# EAGLE design homecomputer-6502 (EAGLE 6.5.0)

## Sheet 1 of 5
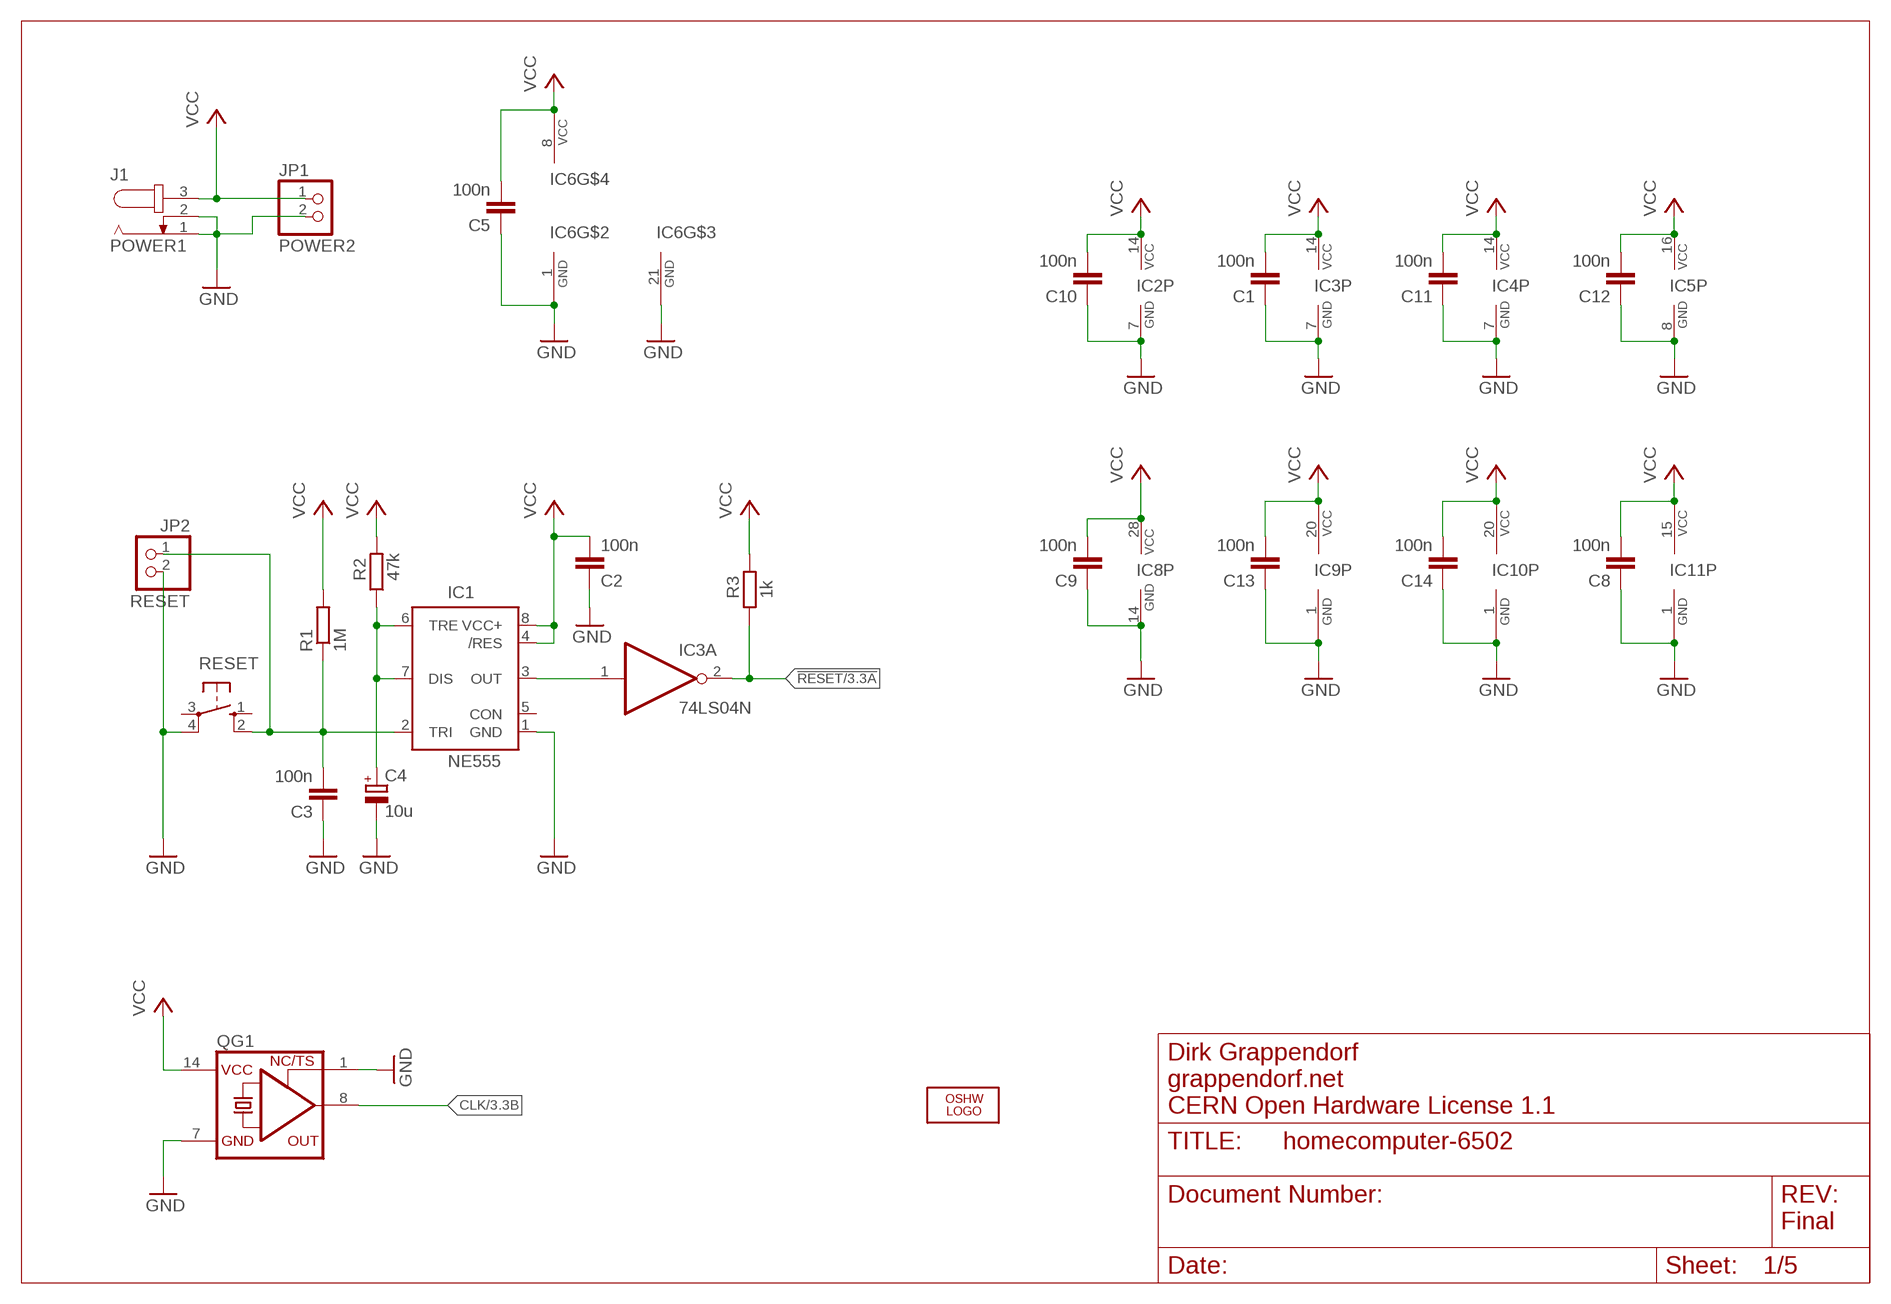
[diagram p0: schematic, sheet 1]

### Parts
C1  100n  C-EU025-024X044  [C025-024X044]
C2  100n  C-EU025-024X044  [C025-024X044]
C3  100n  C-EU025-024X044  [C025-024X044]
C4  10u  CPOL-EUE2,5-6E  [E2,5-6E]
C5  100n  C-EU025-024X044  [C025-024X044]
C8  100n  C-EU025-024X044  [C025-024X044]
C9  100n  C-EU025-024X044  [C025-024X044]
C10  100n  C-EU025-024X044  [C025-024X044]
C11  100n  C-EU025-024X044  [C025-024X044]
C12  100n  C-EU025-024X044  [C025-024X044]
C13  100n  C-EU025-024X044  [C025-024X044]
C14  100n  C-EU025-024X044  [C025-024X044]
IC1  NE555  [DIL-08]
IC2  74LS00N  [DIL14]
IC3  74LS04N  [DIL14]
IC4  74LS30N  [DIL14]
IC5  74LS137N  [DIL16]
IC6  6502  [DIP40]
IC8  61256  [DIL28-3]
IC9  6522  [DIP40]
IC10  6522  [DIP40]
IC11  6551  [DIP28]
J1  POWER1  JACK-PLUG1  [SPC4078]
JP1  POWER2  PINHD-1X2_2.54  [1X02]
JP2  RESET  PINHD-1X2_2.54  [1X02]
LOGO1  OSHW_LOGO_8MILX0350-NT  [OSHW_8X350_NOTEXT]
QG1  XO-14  [DIL14S]
R1  1M  R-EU_0204/7  [0204/7]
R2  47k  R-EU_0204/7  [0204/7]
R3  1k  R-EU_0204/7  [0204/7]
RESET  10-XX  [B3F-10XX]

### Nets
!RESET: IC3.2(A:O) R3.1 ; also sheet 3,4,5
CLK: QG1.8(OUT) ; also sheet 3
GND: C1.1 C2.1 C3.1 C4.- C5.1 C8.1 C9.1 C10.1 C11.1 C12.1 C13.1 C14.1 IC1.1(GND) IC2.7(P:GND) IC3.7(P:GND) IC4.7(GND) IC5.8(GND) IC6.1(GND) IC6.21(GND) IC8.14(GND) IC9.1(GND) IC10.1(GND) IC11.1(GND) J1.1 J1.2 JP1.2 JP2.2 QG1.1(TS) QG1.7(GND) RESET.4(P1) ; also sheet 2,3,4,5
N$4: C4.+ IC1.6(TRE) IC1.7(DIS) R2.1
N$5: IC1.3(OUT) IC3.1(A:I)
N$6: C3.2 IC1.2(TRI) JP2.1 R1.1 RESET.2(S1)
VCC: C1.2 C2.2 C5.2 C8.2 C9.2 C10.2 C11.2 C12.2 C13.2 C14.2 IC1.4(/RES) IC1.8(VCC+) IC2.14(P:VCC) IC3.14(P:VCC) IC4.14(VCC) IC5.16(VCC) IC6.8(VCC) IC8.28(VCC) IC9.20(VCC) IC10.20(VCC) IC11.15(VCC) J1.3 JP1.1 QG1.14(VCC) R1.2 R2.2 R3.2 ; also sheet 2,3,4,5
Unconnected: IC1.5(CON) IC2.8(C:O) IC2.9(C:I0) IC2.10(C:I1) IC2.11(D:O) IC2.12(D:I0) IC2.13(D:I1) IC3.5(C:I) IC3.6(C:O) IC3.8(D:O) IC3.9(D:I) IC3.12(F:O) IC3.13(F:I) RESET.1(S) RESET.3(P)

### Notes on the sheet
- Dirk Grappendorf
- grappendorf.net
- CERN Open Hardware License 1.1
- Final

## Sheet 2 of 5
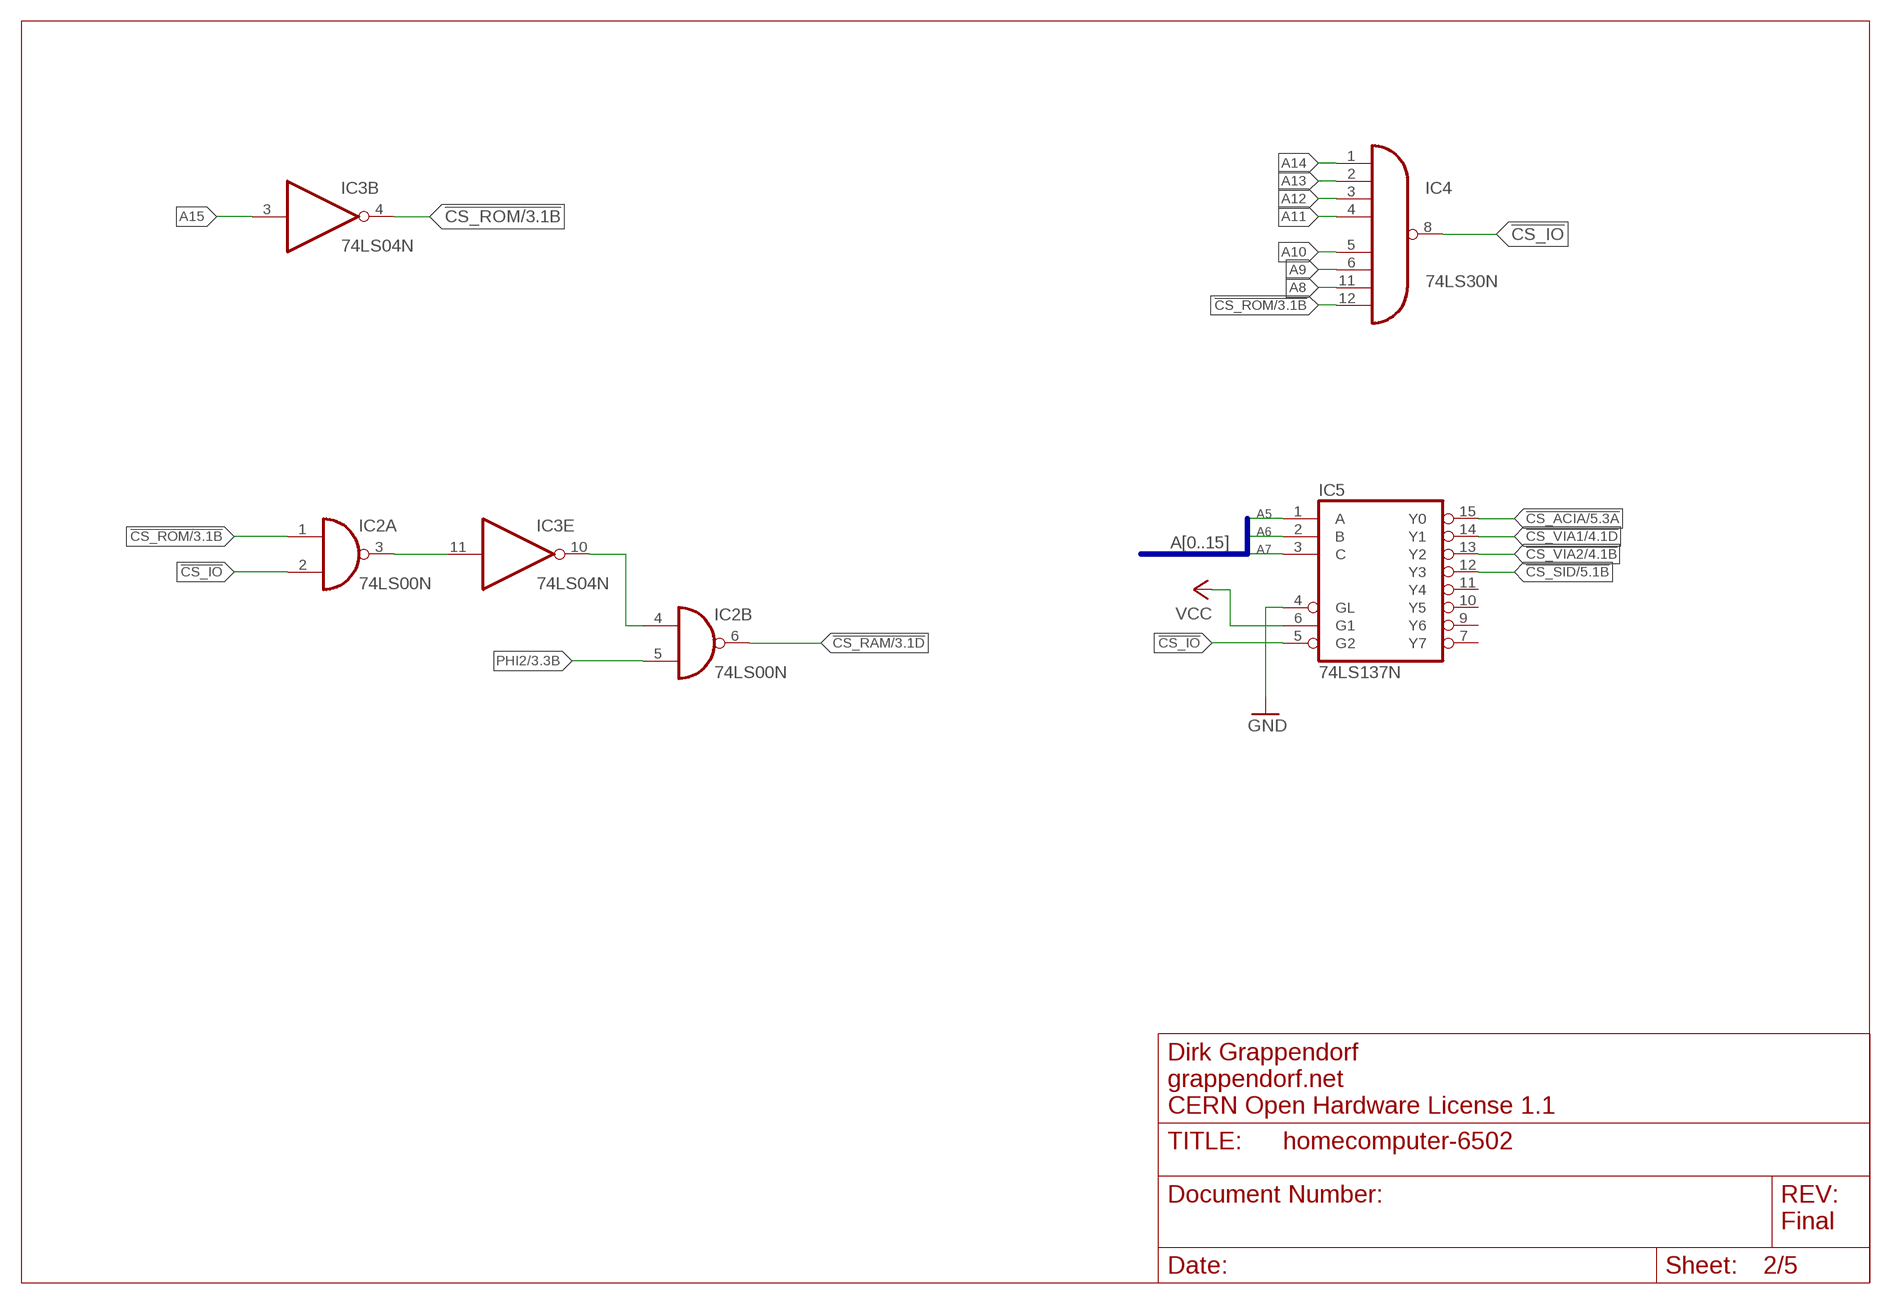
[diagram p1: schematic, sheet 2]

### Nets
!CS_ACIA: IC5.15(Y0) ; also sheet 5
!CS_IO: IC2.2(A:I1) IC4.8(O) IC5.5(G2)
!CS_RAM: IC2.6(B:O) ; also sheet 3
!CS_ROM: IC2.1(A:I0) IC3.4(B:O) IC4.12(I7) ; also sheet 3
!CS_SID: IC5.12(Y3) ; also sheet 5
!CS_VIA1: IC5.14(Y1) ; also sheet 4
!CS_VIA2: IC5.13(Y2) ; also sheet 4
A5: IC5.1(A) ; also sheet 3
A6: IC5.2(B) ; also sheet 3
A7: IC5.3(C) ; also sheet 3
A8: IC4.11(I6) ; also sheet 3
A9: IC4.6(I5) ; also sheet 3
A10: IC4.5(I4) ; also sheet 3
A11: IC4.4(I3) ; also sheet 3
A12: IC4.3(I2) ; also sheet 3
A13: IC4.2(I1) ; also sheet 3
A14: IC4.1(I0) ; also sheet 3
A15: IC3.3(B:I) ; also sheet 3
GND: IC5.4(GL) ; also sheet 1,3,4,5
N$7: IC2.3(A:O) IC3.11(E:I)
N$13: IC2.4(B:I0) IC3.10(E:O)
PHI2: IC2.5(B:I1) ; also sheet 3,4,5
VCC: IC5.6(G1) ; also sheet 1,3,4,5
Unconnected: IC5.7(Y7) IC5.9(Y6) IC5.10(Y5) IC5.11(Y4)

### Buses
A[0..15]

### Notes on the sheet
- Dirk Grappendorf
- grappendorf.net
- CERN Open Hardware License 1.1
- Final

## Sheet 3 of 5
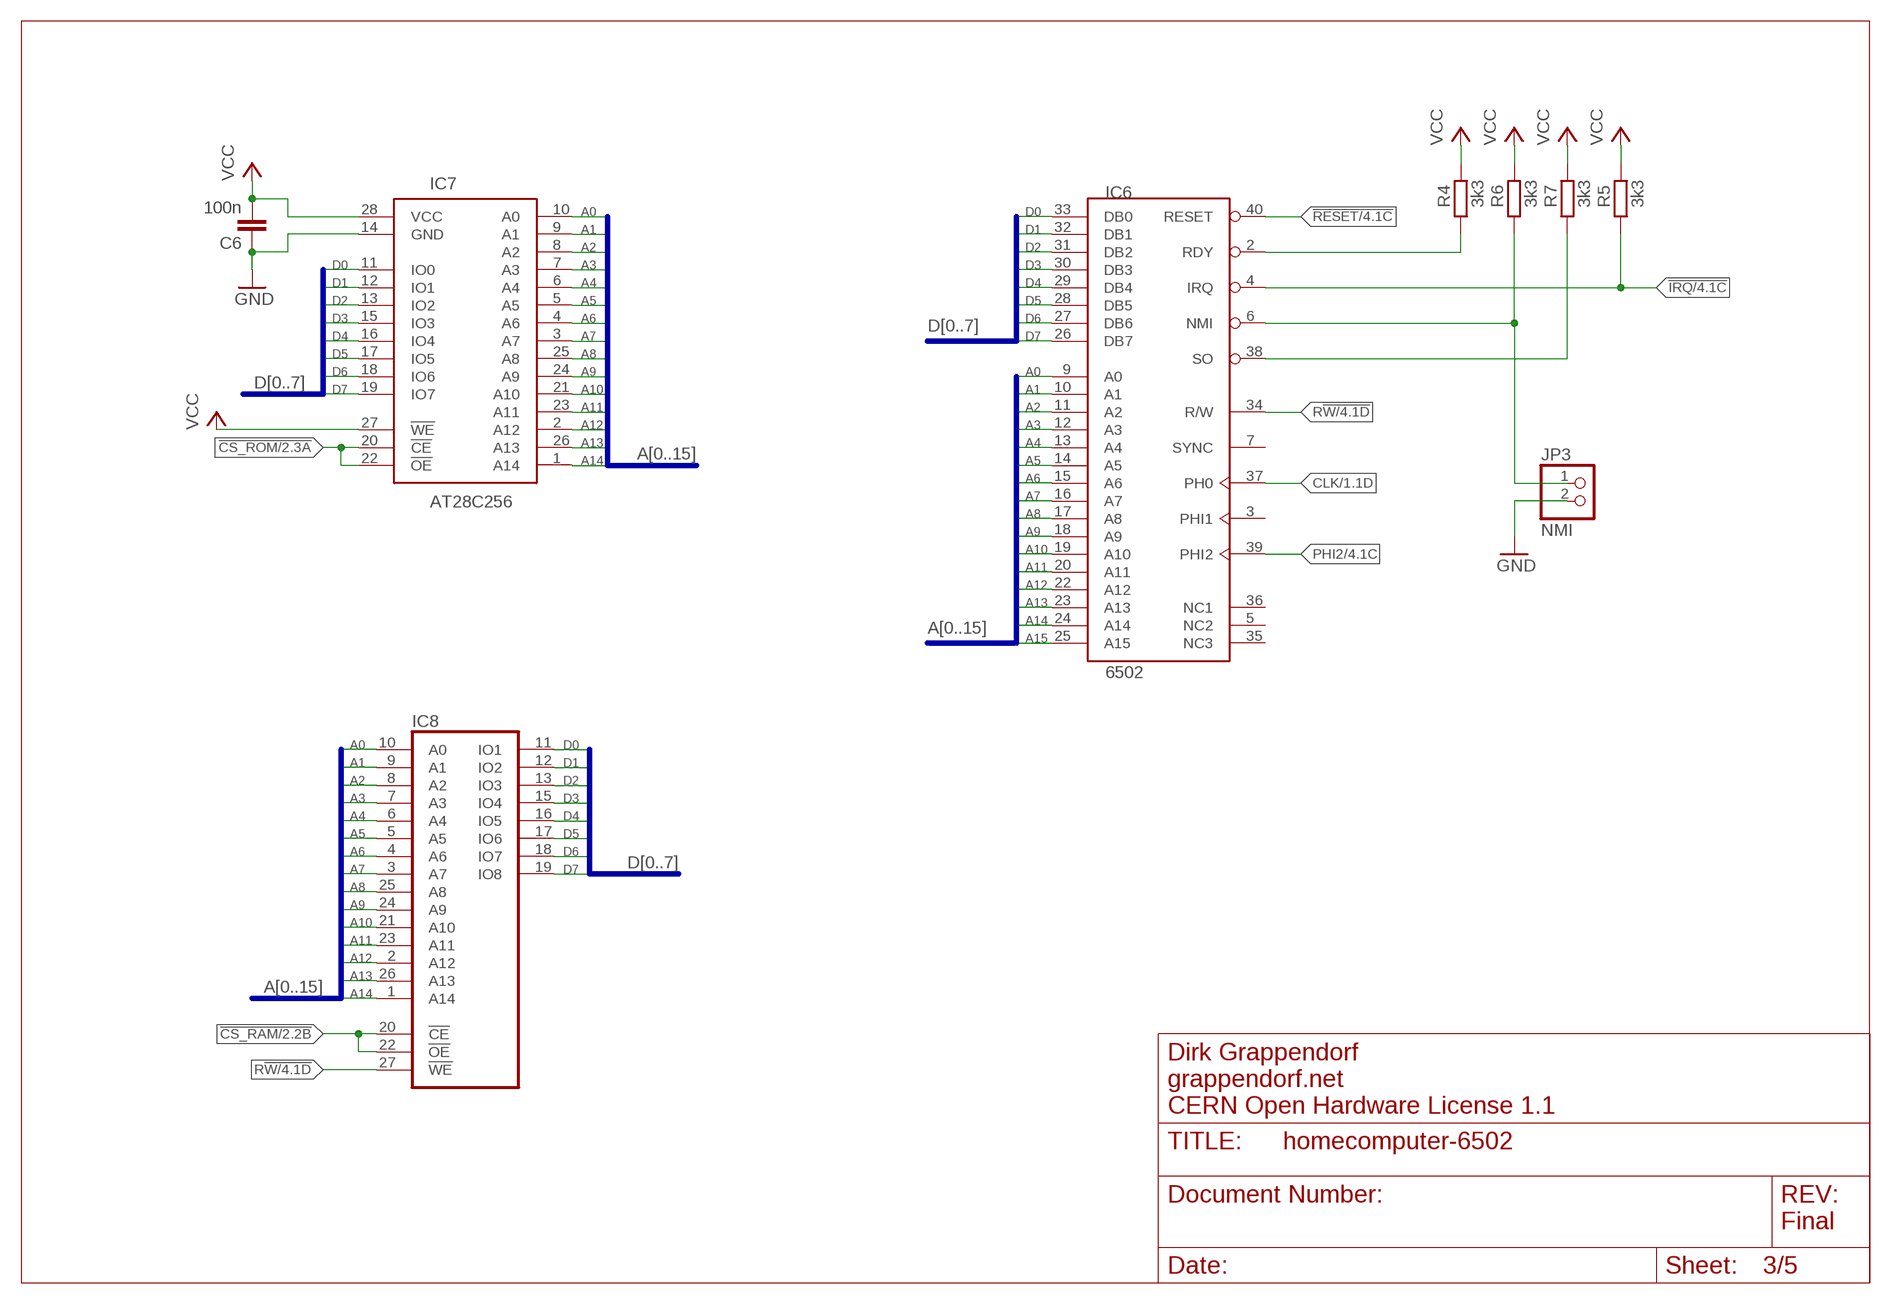
[diagram p2: schematic, sheet 3]

### Parts
C6  100n  C-EU025-024X044  [C025-024X044]
IC7  AT28C256  [DIL28-6]
JP3  NMI  PINHD-1X2_2.54  [1X02]
R4  3k3  R-EU_0204/7  [0204/7]
R5  3k3  R-EU_0204/7  [0204/7]
R6  3k3  R-EU_0204/7  [0204/7]
R7  3k3  R-EU_0204/7  [0204/7]

### Nets
!CS_RAM: IC8.20(!CE) IC8.22(!OE) ; also sheet 2
!CS_ROM: IC7.20(!CE) IC7.22(!OE) ; also sheet 2
!IRQ: IC6.4(IRQ) R5.1 ; also sheet 4,5
!RESET: IC6.40(RESET) ; also sheet 1,4,5
A0: IC6.9(A0) IC7.10(A0) IC8.10(A0) ; also sheet 4,5
A1: IC6.10(A1) IC7.9(A1) IC8.9(A1) ; also sheet 4,5
A2: IC6.11(A2) IC7.8(A2) IC8.8(A2) ; also sheet 4,5
A3: IC6.12(A3) IC7.7(A3) IC8.7(A3) ; also sheet 4,5
A4: IC6.13(A4) IC7.6(A4) IC8.6(A4) ; also sheet 5
A5: IC6.14(A5) IC7.5(A5) IC8.5(A5) ; also sheet 2
A6: IC6.15(A6) IC7.4(A6) IC8.4(A6) ; also sheet 2
A7: IC6.16(A7) IC7.3(A7) IC8.3(A7) ; also sheet 2
A8: IC6.17(A8) IC7.25(A8) IC8.25(A8) ; also sheet 2
A9: IC6.18(A9) IC7.24(A9) IC8.24(A9) ; also sheet 2
A10: IC6.19(A10) IC7.21(A10) IC8.21(A10) ; also sheet 2
A11: IC6.20(A11) IC7.23(A11) IC8.23(A11) ; also sheet 2
A12: IC6.22(A12) IC7.2(A12) IC8.2(A12) ; also sheet 2
A13: IC6.23(A13) IC7.26(A13) IC8.26(A13) ; also sheet 2
A14: IC6.24(A14) IC7.1(A14) IC8.1(A14) ; also sheet 2
A15: IC6.25(A15) ; also sheet 2
CLK: IC6.37(PH0) ; also sheet 1
D0: IC6.33(DB0) IC7.11(IO0) IC8.11(IO1) ; also sheet 4,5
D1: IC6.32(DB1) IC7.12(IO1) IC8.12(IO2) ; also sheet 4,5
D2: IC6.31(DB2) IC7.13(IO2) IC8.13(IO3) ; also sheet 4,5
D3: IC6.30(DB3) IC7.15(IO3) IC8.15(IO4) ; also sheet 4,5
D4: IC6.29(DB4) IC7.16(IO4) IC8.16(IO5) ; also sheet 4,5
D5: IC6.28(DB5) IC7.17(IO5) IC8.17(IO6) ; also sheet 4,5
D6: IC6.27(DB6) IC7.18(IO6) IC8.18(IO7) ; also sheet 4,5
D7: IC6.26(DB7) IC7.19(IO7) IC8.19(IO8) ; also sheet 4,5
GND: C6.1 IC7.14(GND) JP3.2 ; also sheet 1,2,4,5
N$3: IC6.2(RDY) R4.1
N$10: IC6.6(NMI) JP3.1 R6.1
N$11: IC6.38(SO) R7.1
PHI2: IC6.39(PHI2) ; also sheet 2,4,5
R!W: IC6.34(R/W) IC8.27(!WE) ; also sheet 4,5
VCC: C6.2 IC7.27(!WE) IC7.28(VCC) R4.2 R5.2 R6.2 R7.2 ; also sheet 1,2,4,5
Unconnected: IC6.3(PHI1) IC6.5(NC2) IC6.7(SYNC) IC6.35(NC3) IC6.36(NC1)

### Buses
A[0..15]
D[0..7]

### Notes on the sheet
- Dirk Grappendorf
- grappendorf.net
- CERN Open Hardware License 1.1
- Final

## Sheet 4 of 5
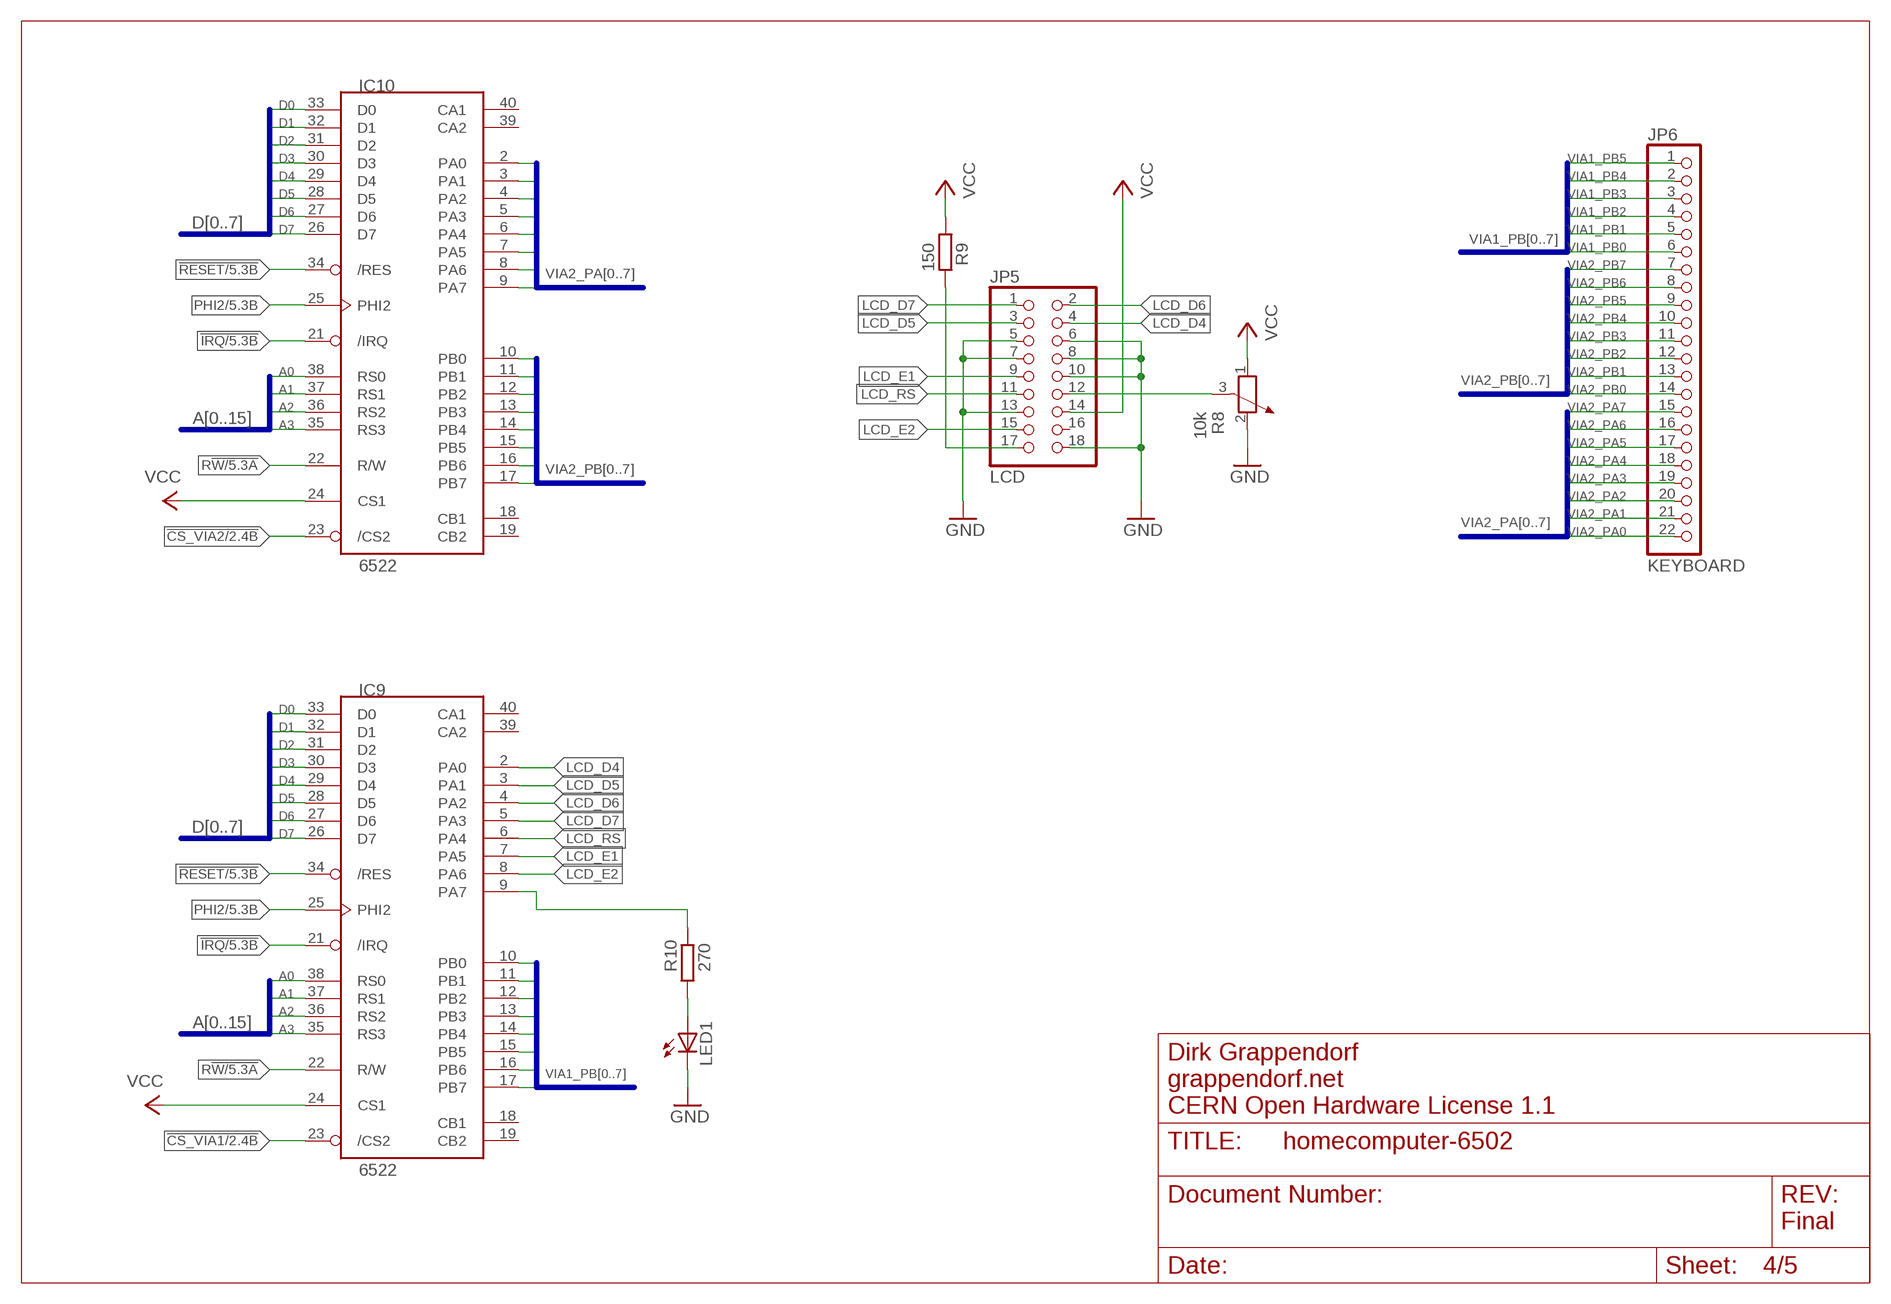
[diagram p3: schematic, sheet 4]

### Parts
JP5  LCD  PINHD-2X9_2.54  [2X09]
JP6  KEYBOARD  PINHD-1X22_2.54  [1X22]
LED1  LED3MM  [LED3MM]
R8  10k  POTENTIOMETER_PT-10  [PT-10]
R9  150  R-EU_0204/7  [0204/7]
R10  270  R-EU_0204/7  [0204/7]

### Nets
!CS_VIA1: IC9.23(/CS2) ; also sheet 2
!CS_VIA2: IC10.23(/CS2) ; also sheet 2
!IRQ: IC9.21(/IRQ) IC10.21(/IRQ) ; also sheet 3,5
!RESET: IC9.34(/RES) IC10.34(/RES) ; also sheet 1,3,5
A0: IC9.38(RS0) IC10.38(RS0) ; also sheet 3,5
A1: IC9.37(RS1) IC10.37(RS1) ; also sheet 3,5
A2: IC9.36(RS2) IC10.36(RS2) ; also sheet 3,5
A3: IC9.35(RS3) IC10.35(RS3) ; also sheet 3,5
D0: IC9.33(D0) IC10.33(D0) ; also sheet 3,5
D1: IC9.32(D1) IC10.32(D1) ; also sheet 3,5
D2: IC9.31(D2) IC10.31(D2) ; also sheet 3,5
D3: IC9.30(D3) IC10.30(D3) ; also sheet 3,5
D4: IC9.29(D4) IC10.29(D4) ; also sheet 3,5
D5: IC9.28(D5) IC10.28(D5) ; also sheet 3,5
D6: IC9.27(D6) IC10.27(D6) ; also sheet 3,5
D7: IC9.26(D7) IC10.26(D7) ; also sheet 3,5
GND: JP5.5 JP5.6 JP5.7 JP5.8 JP5.10 JP5.13 JP5.18 LED1.K(C) R8.2 ; also sheet 1,2,3,5
LCD_D4: IC9.2(PA0) JP5.4
LCD_D5: IC9.3(PA1) JP5.3
LCD_D6: IC9.4(PA2) JP5.2
LCD_D7: IC9.5(PA3) JP5.1
LCD_E1: IC9.7(PA5) JP5.9
LCD_E2: IC9.8(PA6) JP5.15
LCD_RS: IC9.6(PA4) JP5.11
N$9: IC9.9(PA7) R10.2
N$14: JP5.12 R8.3
N$15: JP5.17 R9.2
N$16: LED1.A R10.1
PHI2: IC9.25(PHI2) IC10.25(PHI2) ; also sheet 2,3,5
R!W: IC9.22(R/W) IC10.22(R/W) ; also sheet 3,5
VCC: IC9.24(CS1) IC10.24(CS1) JP5.14 R8.1 R9.1 ; also sheet 1,2,3,5
VIA1_PB0: IC9.10(PB0) JP6.6
VIA1_PB1: IC9.11(PB1) JP6.5
VIA1_PB2: IC9.12(PB2) JP6.4
VIA1_PB3: IC9.13(PB3) JP6.3
VIA1_PB4: IC9.14(PB4) JP6.2
VIA1_PB5: IC9.15(PB5) JP6.1
VIA1_PB6: IC9.16(PB6)
VIA1_PB7: IC9.17(PB7)
VIA2_PA0: IC10.2(PA0) JP6.22
VIA2_PA1: IC10.3(PA1) JP6.21
VIA2_PA2: IC10.4(PA2) JP6.20
VIA2_PA3: IC10.5(PA3) JP6.19
VIA2_PA4: IC10.6(PA4) JP6.18
VIA2_PA5: IC10.7(PA5) JP6.17
VIA2_PA6: IC10.8(PA6) JP6.16
VIA2_PA7: IC10.9(PA7) JP6.15
VIA2_PB0: IC10.10(PB0) JP6.14
VIA2_PB1: IC10.11(PB1) JP6.13
VIA2_PB2: IC10.12(PB2) JP6.12
VIA2_PB3: IC10.13(PB3) JP6.11
VIA2_PB4: IC10.14(PB4) JP6.10
VIA2_PB5: IC10.15(PB5) JP6.9
VIA2_PB6: IC10.16(PB6) JP6.8
VIA2_PB7: IC10.17(PB7) JP6.7
Unconnected: IC9.18(CB1) IC9.19(CB2) IC9.39(CA2) IC9.40(CA1) IC10.18(CB1) IC10.19(CB2) IC10.39(CA2) IC10.40(CA1) JP5.16

### Buses
A[0..15]
D[0..7]
VIA2_PA[0..7]
VIA2_PB[0..7]
VIA1_PB[0..7]

### Notes on the sheet
- Dirk Grappendorf
- grappendorf.net
- CERN Open Hardware License 1.1
- Final

## Sheet 5 of 5
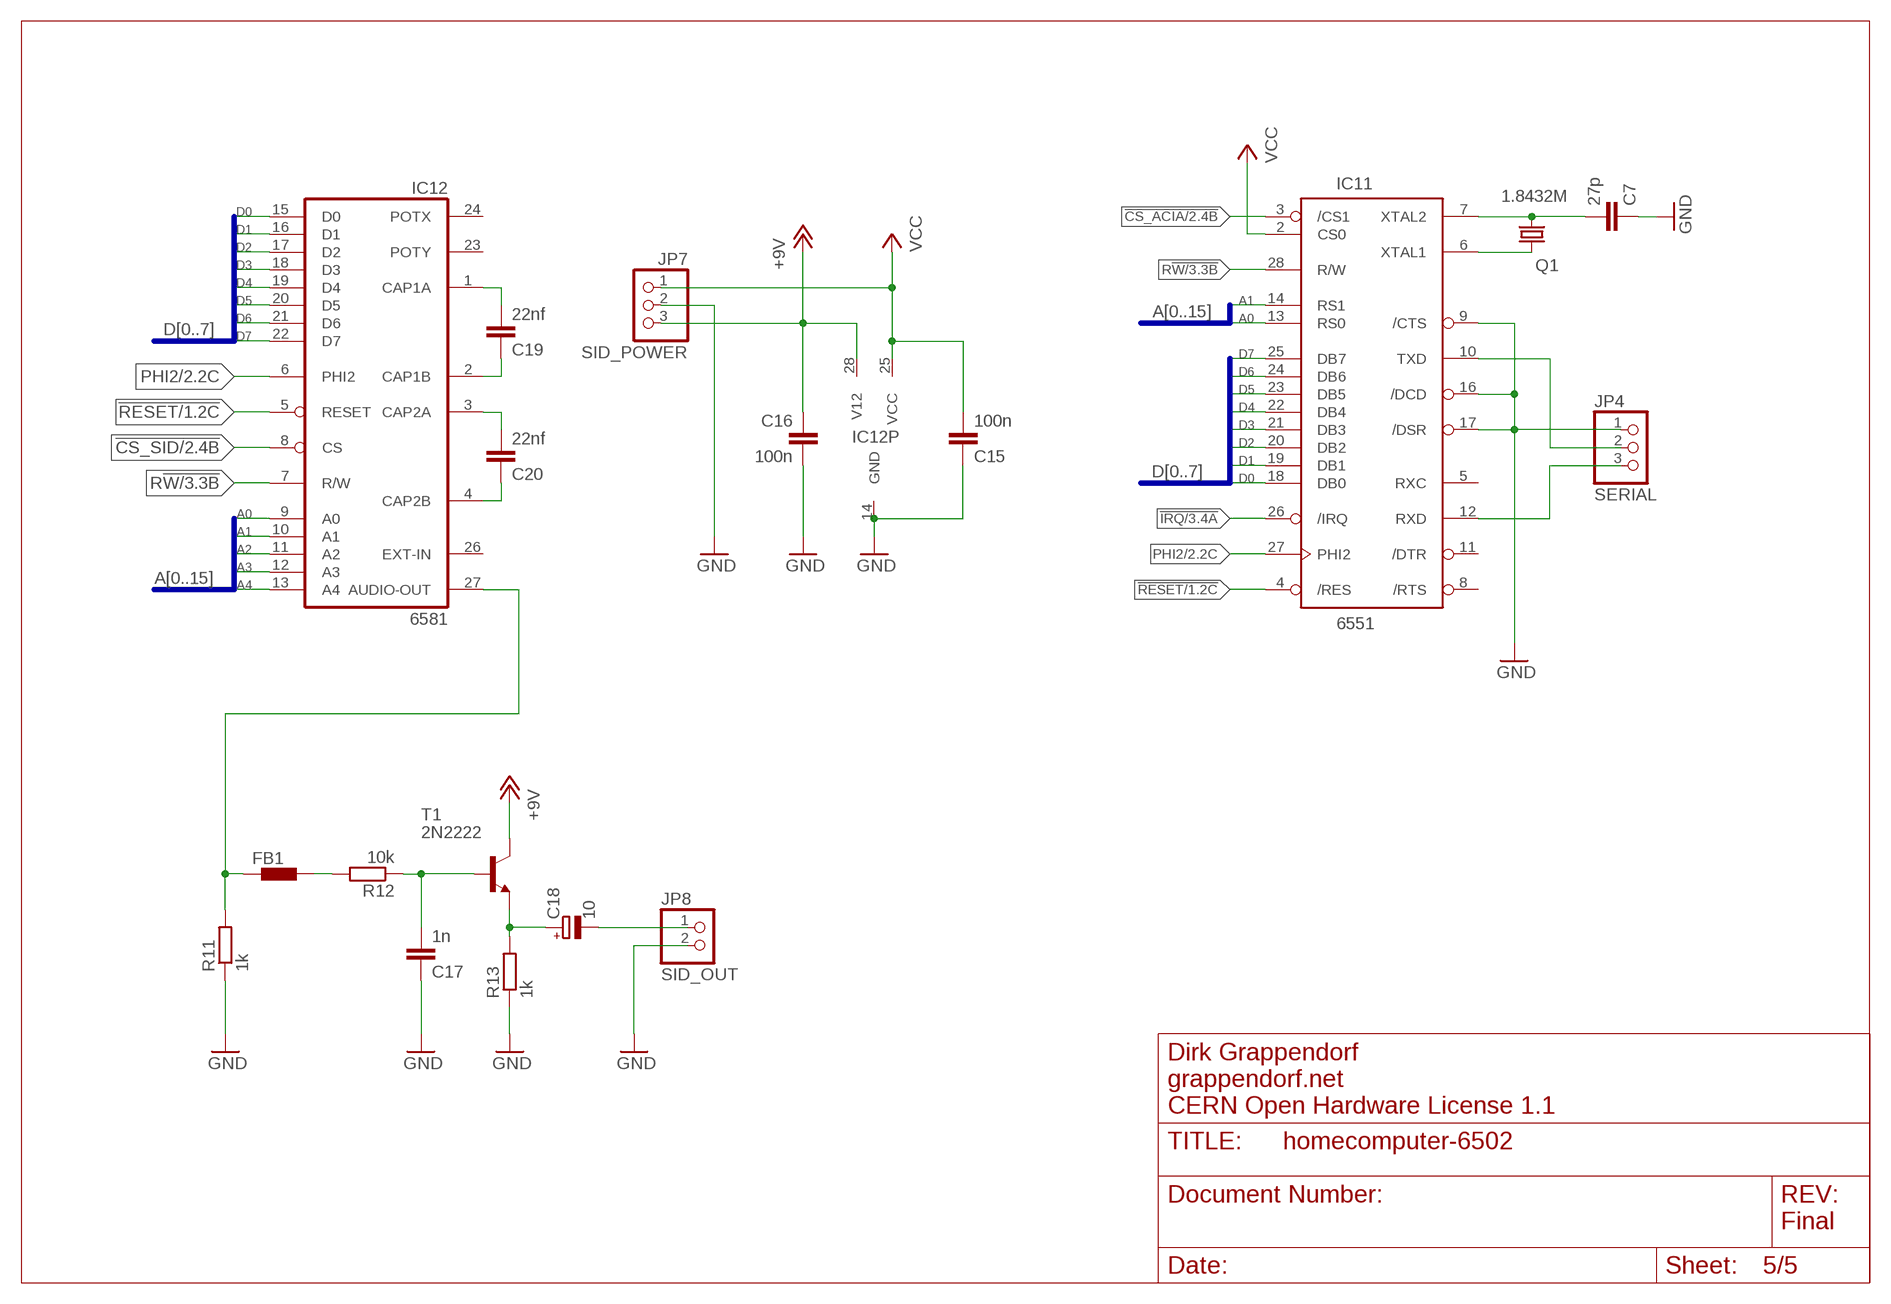
[diagram p4: schematic, sheet 5]

### Parts
C7  27p  C-EU025-024X044  [C025-024X044]
C15  100n  C-EU025-024X044  [C025-024X044]
C16  100n  C-EU025-024X044  [C025-024X044]
C17  1n  C-EU025-024X044  [C025-024X044]
C18  10  CPOL-EUE2.5-5  [E2,5-5]
C19  22nf  C-EU025-024X044  [C025-024X044]
C20  22nf  C-EU025-024X044  [C025-024X044]
FB1  BL01RN1A  [BL01RN1A]
IC12  6581  [DIL28]
JP4  SERIAL  PINHD-1X3_2.54  [1X03]
JP7  SID_POWER  PINHD-1X3_2.54  [1X03]
JP8  SID_OUT  PINHD-1X2_2.54  [1X02]
Q1  1.8432M  CRYSTALHC49U-V  [HC49U-V]
R11  1k  R-EU_0204/7  [0204/7]
R12  10k  R-EU_0204/7  [0204/7]
R13  1k  R-EU_0204/5  [0204/5]
T1  2N2222  [TO18]

### Nets
!CS_ACIA: IC11.3(/CS1) ; also sheet 2
!CS_SID: IC12.8(CS) ; also sheet 2
!IRQ: IC11.26(/IRQ) ; also sheet 3,4
!RESET: IC11.4(/RES) IC12.5(RESET) ; also sheet 1,3,4
+12V: C16.1 IC12.28(V12) JP7.3 T1.3(C) ; supply symbol labelled +9V
A0: IC11.13(RS0) IC12.9(A0) ; also sheet 3,4
A1: IC11.14(RS1) IC12.10(A1) ; also sheet 3,4
A2: IC12.11(A2) ; also sheet 3,4
A3: IC12.12(A3) ; also sheet 3,4
A4: IC12.13(A4) ; also sheet 3
D0: IC11.18(DB0) IC12.15(D0) ; also sheet 3,4
D1: IC11.19(DB1) IC12.16(D1) ; also sheet 3,4
D2: IC11.20(DB2) IC12.17(D2) ; also sheet 3,4
D3: IC11.21(DB3) IC12.18(D3) ; also sheet 3,4
D4: IC11.22(DB4) IC12.19(D4) ; also sheet 3,4
D5: IC11.23(DB5) IC12.20(D5) ; also sheet 3,4
D6: IC11.24(DB6) IC12.21(D6) ; also sheet 3,4
D7: IC11.25(DB7) IC12.22(D7) ; also sheet 3,4
GND: C7.1 C15.1 C16.2 C17.1 IC11.9(/CTS) IC11.16(/DCD) IC11.17(/DSR) IC12.14(GND) JP4.1 JP7.2 JP8.2 R11.1 R13.1 ; also sheet 1,2,3,4
N$1: C7.2 IC11.7(XTAL2) Q1.2
N$2: IC11.6(XTAL1) Q1.1
N$8: IC11.10(TXD) JP4.2
N$12: IC11.12(RXD) JP4.3
N$17: FB1.1 IC12.27(AUDIO-OUT) R11.2
N$18: C19.2 IC12.1(CAP1A)
N$19: FB1.2 R12.2
N$20: C17.2 R12.1 T1.2(B)
N$21: C18.+ R13.2 T1.1(E)
N$22: C18.- JP8.1
N$24: C19.1 IC12.2(CAP1B)
N$25: C20.2 IC12.3(CAP2A)
N$26: C20.1 IC12.4(CAP2B)
PHI2: IC11.27(PHI2) IC12.6(PHI2) ; also sheet 2,3,4
R!W: IC11.28(R/W) IC12.7(R/W) ; also sheet 3,4
VCC: C15.2 IC11.2(CS0) IC12.25(VCC) JP7.1 ; also sheet 1,2,3,4
Unconnected: IC11.5(RXC) IC11.8(/RTS) IC11.11(/DTR) IC12.23(POTY) IC12.24(POTX) IC12.26(EXT-IN)

### Buses
A[0..15]
D[0..7]

### Notes on the sheet
- Dirk Grappendorf
- grappendorf.net
- CERN Open Hardware License 1.1
- Final

## Library data of the parts
C1-C3 C5-C17 C19 C20 = rcl:C-EU: CAPACITOR, European symbol
C4 C18 = rcl:CPOL-EU: POLARIZED CAPACITOR, European symbol
FB1 = inductors:BL0: Noise Suppression Products/EMI Suppression Filters, Lead EMIFIL(R) Inductor Type Source: http://www.murata.com .. BL01RN1_DS.pdf
IC1 = st-microelectronics:NE555: General purpose bipolar Timer; MF: Arrow Electronics; MPN: NE555N; OC_FARNELL: 1467742; OC_NEWARK: 89K1486
IC2 = 74xx-eu:74*00: Quad 2-input NAND gate
IC3 = 74xx-eu:74*04: Hex INVERTER
IC4 = 74xx-eu:74*30: 8-input NAND gate
IC5 = 74xx-eu:74*137: 3-line to 8-line DECODER/DEMULTIPLEXER, address LATCH
IC6 = 6502:6502: 6502 processor
IC7 = atmel-28c:AT28C256: EEPROM 32Kx8 256k bit The AT28C256 is a high-performance Electrically Erasable and Programmable Read Only Memory. Its 256K of memory is organized as 32,768 words by 8 bits.
IC8 = grapelabs:61256: MEMORY
IC9 IC10 = 6502:6522: I/O device: two 8-bits ports, handshake lines, timers.
IC11 = 6502:6551: ACIA. Capable of RS-232
IC12 = 6502:6581: Sound IC, used in Comoodore 64 and Comoodore 128. 12 Volt Version. 8580 is the 9 Volt pin compatible version used in the C64C.
J1 = con-jack:JACK-PLUG: DC POWER JACK Power Jack, DC, Right Angle, Through Hole, Rated 5A at 16VDC, PC Terminals Distributor: Farnell (www.Farnell.de) Drawing: 84N1161.pdf / 84N1162.pdf Manufacturer: SPC Technology (www.spctechnology.com) Type: SPC4077 / SPC 4078; OC_FARNELL: unknown; OC_NEWARK: unknown
JP1-JP3 JP8 = pinhead-1:PINHD-1X2: PIN HEADER
JP4 JP7 = pinhead-1:PINHD-1X3: PIN HEADER
JP5 = pinhead-1:PINHD-2X9: PIN HEADER
JP6 = pinhead-1:PINHD-1X22: PIN HEADER
LED1 = led:LED: LED OSRAM: - CHIPLED LG R971, LG N971, LY N971, LG Q971, LY Q971, LO R971, LY R971 LH N974, LH R974 LS Q976, LO Q976, LY Q976 LO Q996 - Hyper CHIPLED LW Q18S LB Q993, LB Q99A, LB R99A - SideLED LS A670, LO A670, LY A670, LG A670, LP A670 LB A673, LV A673, LT A673, LW A673 LH A674 LY A675 LS A676, LA A676, LO A676, LY A676, LW A676 LS A679, LY A679, LG A679 - Hyper Micro SIDELED® LS Y876, LA Y876, LO Y876, LY Y876 LT Y87S - SmartLED LW L88C, LW L88S LB L89C, LB L89S, LG L890 LS L89K, LO L89K, LY L89K LS L896, LA L896, LO L896, LY L896 - TOPLED LS T670, LO T670, LY T670, LG T670, LP T670 LSG T670, LSP T670, LSY T670, LOP T670, LYG T670 LG T671, LOG T671, LSG T671 LB T673, LV T673, LT T673, LW T673 LH T674 LS T676, LA T676, LO T676, LY T676, LB T676, LH T676, LSB T676, LW T676 LB T67C, LV T67C, LT T67C, LS T67K, LO T67K, LY T67K, LW E67C LS E67B, LA E67B, LO E67B, LY E67B, LB E67C, LV E67C, LT E67C LW T67C LS T679, LY T679, LG T679 LS T770, LO T770, LY T770, LG T770, LP T770 LB T773, LV T773, LT T773, LW T773 LH T774 LS E675, LA E675, LY E675, LS T675 LS T776, LA T776, LO T776, LY T776, LB T776 LHGB T686 LT T68C, LB T68C - Hyper Mini TOPLED® LB M676 - Mini TOPLED Santana® LG M470 LS M47K, LO M47K, LY M47K Source: http://www.osram.convergy.de LUXEON: - LUMILED® LXK2-PW12-R00, LXK2-PW12-S00, LXK2-PW14-U00, LXK2-PW14-V00 LXK2-PM12-R00, LXK2-PM12-S00, LXK2-PM14-U00 LXK2-PE12-Q00, LXK2-PE12-R00, LXK2-PE12-S00, LXK2-PE14-T00, LXK2-PE14-U00 LXK2-PB12-K00, LXK2-PB12-L00, LXK2-PB12-M00, LXK2-PB14-N00, LXK2-PB14-P00, LXK2-PB14-Q00 LXK2-PR12-L00, LXK2-PR12-M00, LXK2-PR14-Q00, LXK2-PR14-R00 LXK2-PD12-Q00, LXK2-PD12-R00, LXK2-PD12-S00 LXK2-PH12-R00, LXK2-PH12-S00 LXK2-PL12-P00, LXK2-PL12-Q00, LXK2-PL12-R00 Source: www.luxeon.com KINGBRIGHT: KA-3528ASYC Source: www.kingbright.com
LOGO1 = OSHW:OSHW_LOGO_8MIL
Q1 = crystal:CRYSTAL: CRYSTAL; OC_FARNELL: 1666969; OC_NEWARK: unknown
QG1 = crystal2:XO-: CRYSTAL
R1-R7 R9-R13 = rcl:R-EU_: RESISTOR, European symbol
R8 = rcl:POTENTIOMETER_: Potentiometer
RESET = switch-omron:10-XX: OMRON SWITCH; MPN: B3F-1000; OC_FARNELL: 176432; OC_NEWARK: 36M3542
T1 = transistor:2N2222: NPN TRANSISTOR

## Board
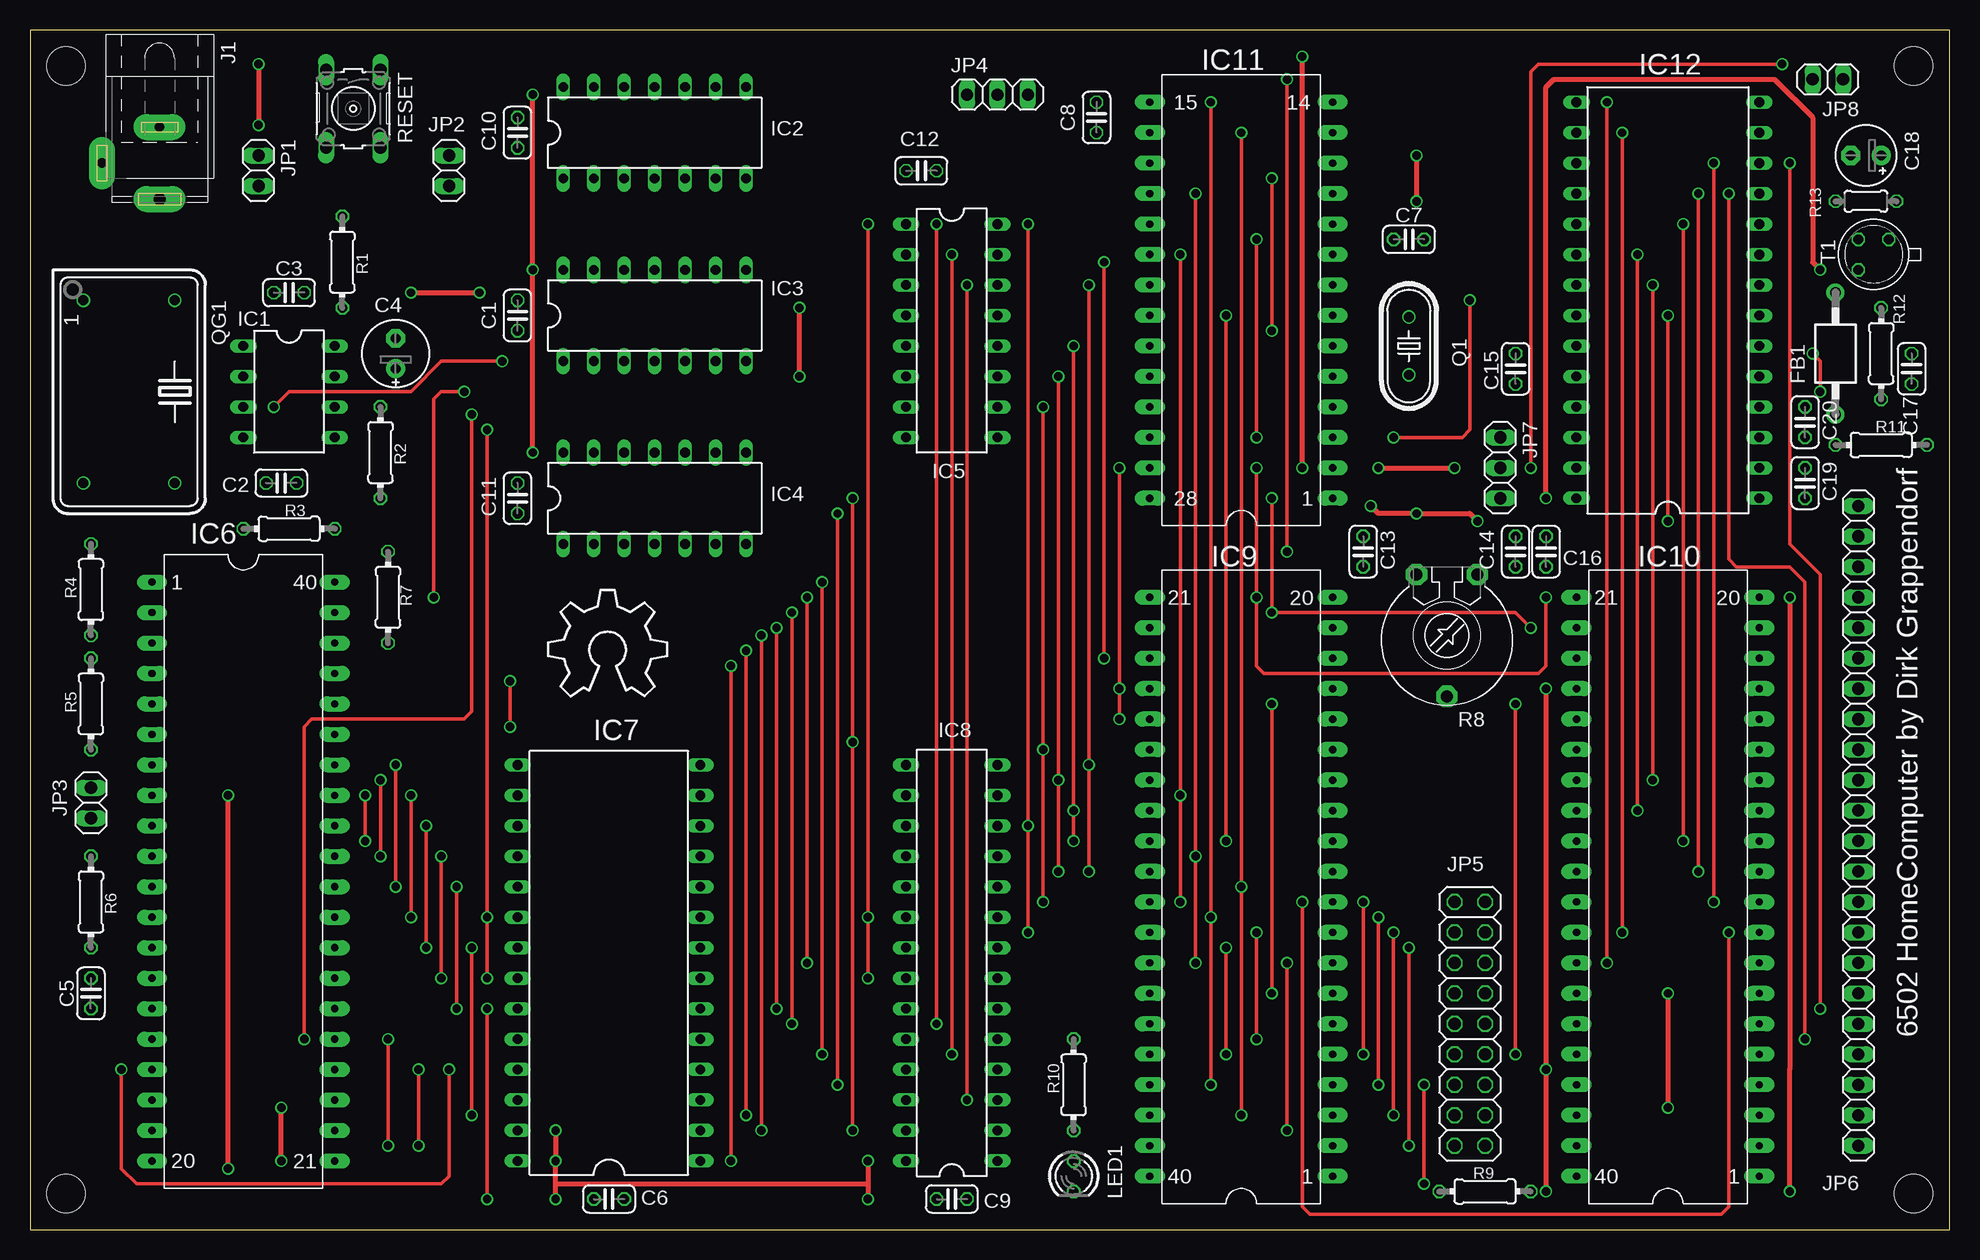
[diagram p5: board, top side]
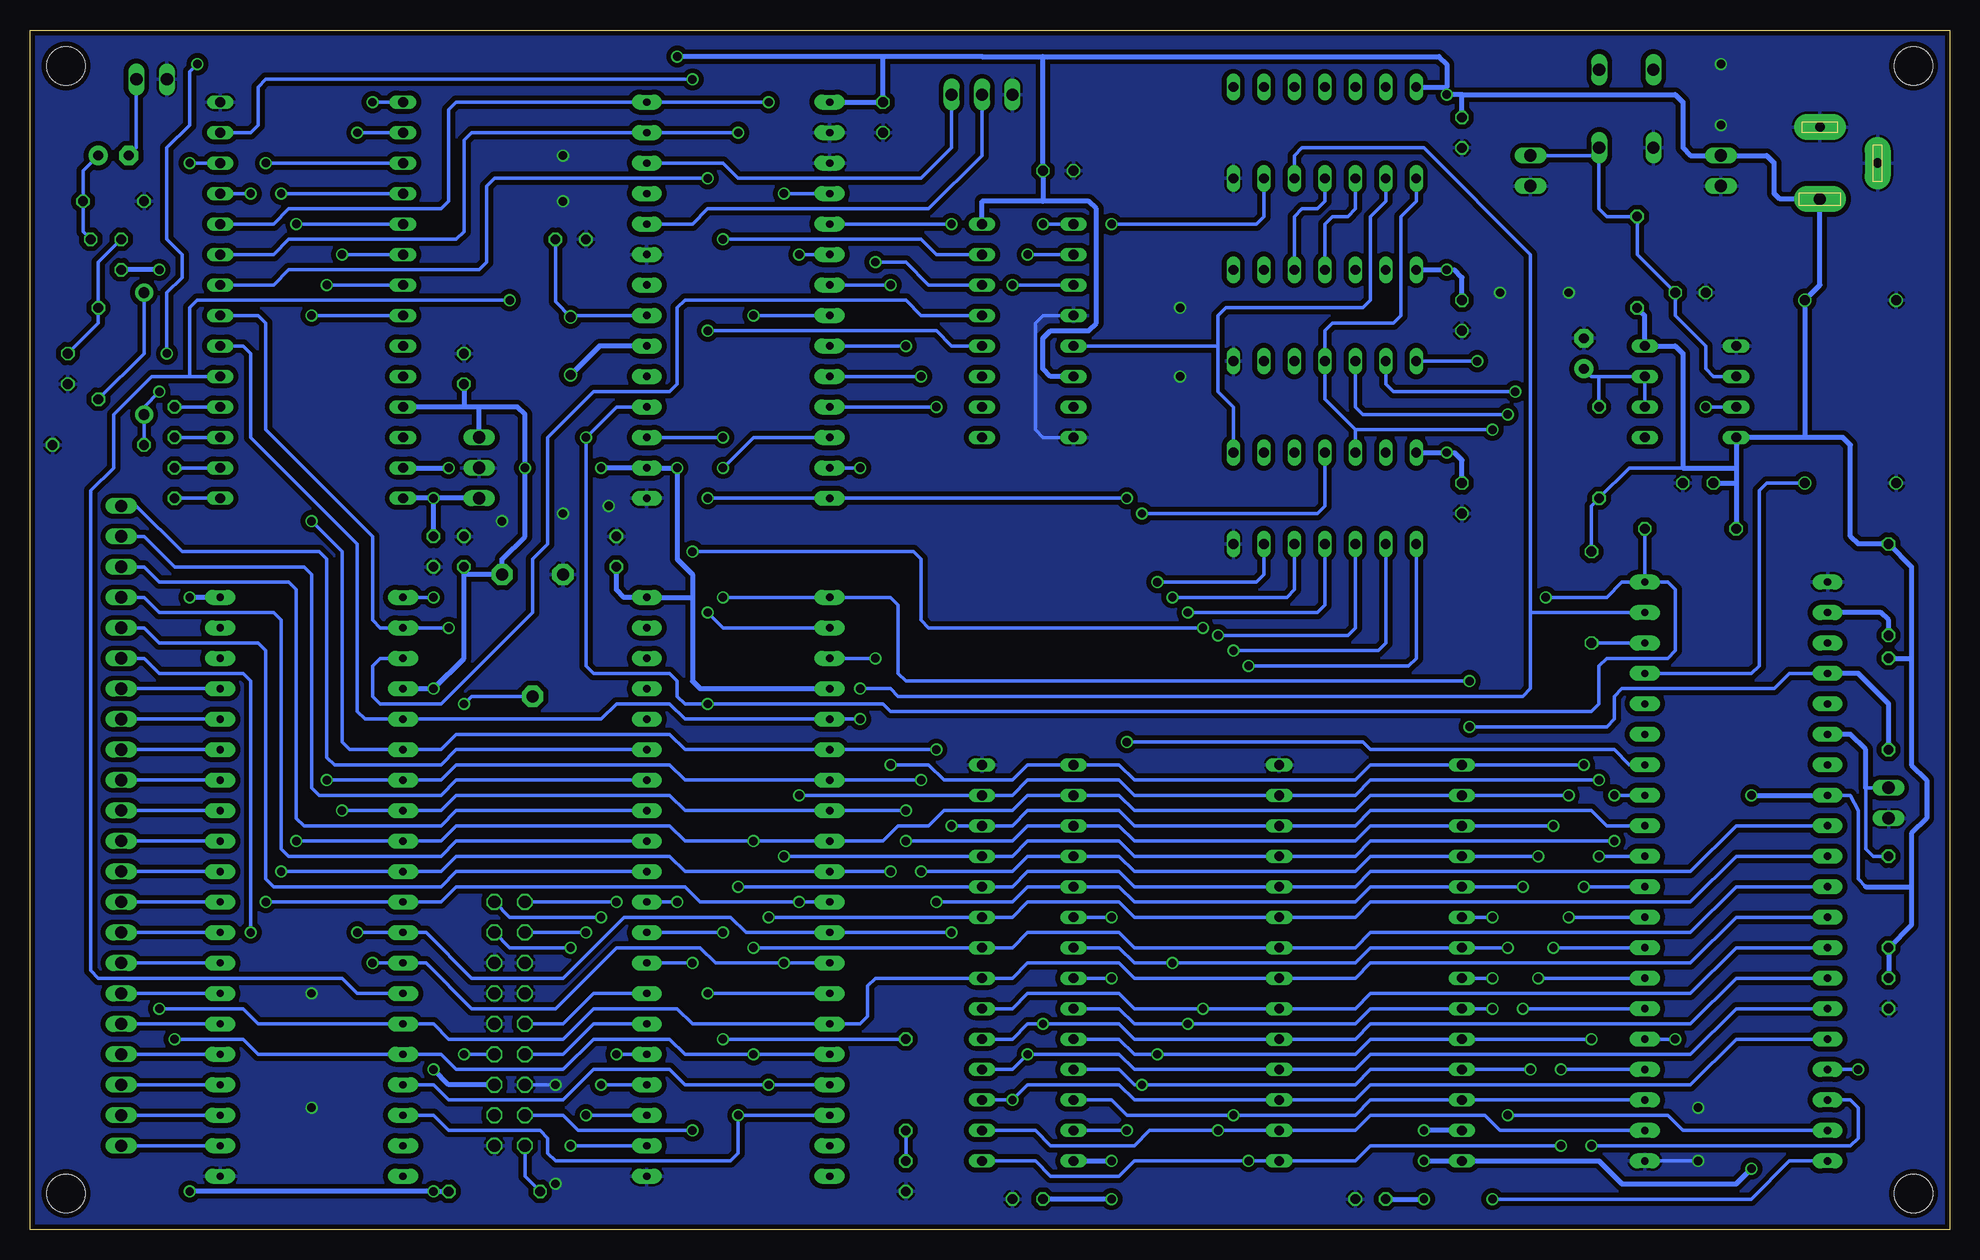
[diagram p6: board, bottom side, seen from below]

Size 160 x 100 mm. Coordinates in mm from the lower left corner, seen from the top.
Outline: 0,0 160,0 160,100 0,100 0,0
Copper layers (1*16): Top 0.035mm / dielectric 1.5mm / Bottom 0.035mm
Design rules "LeitOn - Standard-Eagle-DRU - 1- und  2-Lagen DK - deutsch - Rev 2.0 *": minimum track width 0.15mm, minimum drill 0.3mm, track to track 0.15mm, track to pad 0.15mm, pad to pad 0.15mm, via to via 0.15mm, smd to smd 0.15mm, copper to edge 0.3mm, drill to drill 0.3mm, minimum pad ring 0.15mm, minimum via ring 0.15mm, stop-mask expansion 0.075mm, vias tented up to drill 0mil, thermal gap 0.2mm
Holes 3.2 mm at 3,97 157,97 3,3 157,3

### Footprints (pad centres in the part's own frame; a part is rotated, then mirrored left to right if it is on the bottom)
C025-024X044 = drill 0.813 octagon: 1 -1.27,0; 2 1.27,0
E2,5-6E = drill 0.813 pad 1.575: + -1.27,0 | drill 0.813 pad 1.575 octagon: - 1.27,0
E2,5-5 = drill 0.813 pad 1.6: + -1.27,0 | drill 0.813 pad 1.6 octagon: - 1.27,0
BL01RN1A = drill 0.9 pad 1.5: 1 -5.08,0; 2 5.08,0
DIL-08 = drill 0.813 long: 1 -3.81,-3.81; 2 -1.27,-3.81; 3 1.27,-3.81; 4 3.81,-3.81; 5 3.81,3.81; 6 1.27,3.81; 7 -1.27,3.81; 8 -3.81,3.81
DIL14 = drill 0.813 long: 1 -7.62,-3.81; 2 -5.08,-3.81; 3 -2.54,-3.81; 4 0,-3.81; 5 2.54,-3.81; 6 5.08,-3.81; 7 7.62,-3.81; 8 7.62,3.81; 9 5.08,3.81; 10 2.54,3.81; 11 0,3.81; 12 -2.54,3.81; 13 -5.08,3.81; 14 -7.62,3.81
DIL16 = drill 0.813 long: 1 -8.89,-3.81; 2 -6.35,-3.81; 3 -3.81,-3.81; 4 -1.27,-3.81; 5 1.27,-3.81; 6 3.81,-3.81; 7 6.35,-3.81; 8 8.89,-3.81; 9 8.89,3.81; 10 6.35,3.81; 11 3.81,3.81; 12 1.27,3.81; 13 -1.27,3.81; 14 -3.81,3.81; 15 -6.35,3.81; 16 -8.89,3.81
DIP40 = drill 0.61 pad 1.27 long: 1 -24.13,-7.62; 2 -21.59,-7.62; 3 -19.05,-7.62; 4 -16.51,-7.62; 5 -13.97,-7.62; 6 -11.43,-7.62; 7 -8.89,-7.62; 8 -6.35,-7.62; 9 -3.81,-7.62; 10 -1.27,-7.62; 11 1.27,-7.62; 12 3.81,-7.62; 13 6.35,-7.62; 14 8.89,-7.62; 15 11.43,-7.62; 16 13.97,-7.62; 17 16.51,-7.62; 18 19.05,-7.62; 19 21.59,-7.62; 20 24.13,-7.62; 21 24.13,7.62; 22 21.59,7.62; 23 19.05,7.62; 24 16.51,7.62; 25 13.97,7.62; 26 11.43,7.62; 27 8.89,7.62; 28 6.35,7.62; 29 3.81,7.62; 30 1.27,7.62; 31 -1.27,7.62; 32 -3.81,7.62; 33 -6.35,7.62; 34 -8.89,7.62; 35 -11.43,7.62; 36 -13.97,7.62; 37 -16.51,7.62; 38 -19.05,7.62; 39 -21.59,7.62; 40 -24.13,7.62
DIL28-6 = drill 0.813 long: 1 -16.51,-7.62; 2 -13.97,-7.62; 3 -11.43,-7.62; 4 -8.89,-7.62; 5 -6.35,-7.62; 6 -3.81,-7.62; 7 -1.27,-7.62; 8 1.27,-7.62; 9 3.81,-7.62; 10 6.35,-7.62; 11 8.89,-7.62; 12 11.43,-7.62; 13 13.97,-7.62; 14 16.51,-7.62; 15 16.51,7.62; 16 13.97,7.62; 17 11.43,7.62; 18 8.89,7.62; 19 6.35,7.62; 20 3.81,7.62; 21 1.27,7.62; 22 -1.27,7.62; 23 -3.81,7.62; 24 -6.35,7.62; 25 -8.89,7.62; 26 -11.43,7.62; 27 -13.97,7.62; 28 -16.51,7.62
DIL28-3 = drill 0.813 long: 1 -16.51,-3.81; 2 -13.97,-3.81; 3 -11.43,-3.81; 4 -8.89,-3.81; 5 -6.35,-3.81; 6 -3.81,-3.81; 7 -1.27,-3.81; 8 1.27,-3.81; 9 3.81,-3.81; 10 6.35,-3.81; 11 8.89,-3.81; 12 11.43,-3.81; 13 13.97,-3.81; 14 16.51,-3.81; 15 16.51,3.81; 16 13.97,3.81; 17 11.43,3.81; 18 8.89,3.81; 19 6.35,3.81; 20 3.81,3.81; 21 1.27,3.81; 22 -1.27,3.81; 23 -3.81,3.81; 24 -6.35,3.81; 25 -8.89,3.81; 26 -11.43,3.81; 27 -13.97,3.81; 28 -16.51,3.81
DIP28 = drill 0.61 pad 1.27 long: 1 -16.51,-7.62; 2 -13.97,-7.62; 3 -11.43,-7.62; 4 -8.89,-7.62; 5 -6.35,-7.62; 6 -3.81,-7.62; 7 -1.27,-7.62; 8 1.27,-7.62; 9 3.81,-7.62; 10 6.35,-7.62; 11 8.89,-7.62; 12 11.43,-7.62; 13 13.97,-7.62; 14 16.51,-7.62; 15 16.51,7.62; 16 13.97,7.62; 17 11.43,7.62; 18 8.89,7.62; 19 6.35,7.62; 20 3.81,7.62; 21 1.27,7.62; 22 -1.27,7.62; 23 -3.81,7.62; 24 -6.35,7.62; 25 -8.89,7.62; 26 -11.43,7.62; 27 -13.97,7.62; 28 -16.51,7.62
DIL28 = drill 0.813 long: 1 -16.51,-7.62; 2 -13.97,-7.62; 3 -11.43,-7.62; 4 -8.89,-7.62; 5 -6.35,-7.62; 6 -3.81,-7.62; 7 -1.27,-7.62; 8 1.27,-7.62; 9 3.81,-7.62; 10 6.35,-7.62; 11 8.89,-7.62; 12 11.43,-7.62; 13 13.97,-7.62; 14 16.51,-7.62; 15 16.51,7.62; 16 13.97,7.62; 17 11.43,7.62; 18 8.89,7.62; 19 6.35,7.62; 20 3.81,7.62; 21 1.27,7.62; 22 -1.27,7.62; 23 -3.81,7.62; 24 -6.35,7.62; 25 -8.89,7.62; 26 -11.43,7.62; 27 -13.97,7.62; 28 -16.51,7.62
SPC4078 = drill 0.8 pad 2.184 long: 1 -3,0; 2 0,-4.8 | drill 1 pad 2.184 long: 3 3,0
1X02 = drill 1.016 long: 1 -1.27,0; 2 1.27,0
1X03 = drill 1.016 long: 1 -2.54,0; 2 0,0; 3 2.54,0
2X09 = drill 1.016 octagon: 1 -10.16,-1.27; 2 -10.16,1.27; 3 -7.62,-1.27; 4 -7.62,1.27; 5 -5.08,-1.27; 6 -5.08,1.27; 7 -2.54,-1.27; 8 -2.54,1.27; 9 0,-1.27; 10 0,1.27; 11 2.54,-1.27; 12 2.54,1.27; 13 5.08,-1.27; 14 5.08,1.27; 15 7.62,-1.27; 16 7.62,1.27; 17 10.16,-1.27; 18 10.16,1.27
1X22 = drill 1.016 long: 1 -26.67,0; 2 -24.13,0; 3 -21.59,0; 4 -19.05,0; 5 -16.51,0; 6 -13.97,0; 7 -11.43,0; 8 -8.89,0; 9 -6.35,0; 10 -3.81,0; 11 -1.27,0; 12 1.27,0; 13 3.81,0; 14 6.35,0; 15 8.89,0; 16 11.43,0; 17 13.97,0; 18 16.51,0; 19 19.05,0; 20 21.59,0; 21 24.13,0; 22 26.67,0
LED3MM = drill 0.813 octagon: A -1.27,0; K 1.27,0
HC49U-V = drill 0.813: 1 -2.413,0; 2 2.413,0
DIL14S = drill 0.813: 1 -7.62,-3.81; 7 7.62,-3.81; 8 7.62,3.81; 14 -7.62,3.81
0204/7 = drill 0.813 octagon: 1 -3.81,0; 2 3.81,0
PT-10 = drill 1.016 pad 1.778 octagon: 1 -2.54,-5.08; 2 2.54,-5.08; 3 0,5.08
0204/5 = drill 0.813 octagon: 1 -2.54,0; 2 2.54,0
B3F-10XX = drill 1.016 long: 1 -3.251,2.261; 2 3.251,2.261; 3 -3.251,-2.261; 4 3.251,-2.261
TO18 = drill 0.813 octagon: 1 -1.27,-1.27; 2 1.27,-1.27; 3 1.27,1.27

### Placement (x,y rotation side)
C1  40.64,76.2 90 top
C2  20.95,62.23 180 top
C3  21.59,78.11 0 top
C4  30.48,73.03 90 top
C5  5.08,19.68 90 top
C6  48.26,2.54 180 top
C7  114.94,82.55 0 top
C8  88.9,92.71 90 top
C9  76.83,2.54 180 top
C10  40.64,91.44 90 top
C11  40.64,60.96 90 top
C12  74.3,88.27 0 top
C13  111.12,56.52 270 top
C14  123.83,56.52 270 top
C15  123.83,71.75 270 top
C16  126.36,56.52 270 top
C17  156.84,71.75 90 top
C18  153.03,89.53 180 top
C19  147.96,62.23 270 top
C20  147.96,67.31 270 top
FB1  150.5,73.03 90 top
IC1  21.59,69.85 270 top
IC2  52.07,91.44 0 top
IC3  52.07,76.2 0 top
IC4  52.07,60.96 0 top
IC5  76.83,74.93 270 top
IC6  17.78,29.84 270 top
IC7  48.26,22.23 90 top
IC8  76.83,22.23 90 top
IC9  100.97,28.57 90 top
IC10  136.53,28.57 90 top
IC11  100.97,77.47 90 top
IC12  136.53,77.47 90 top
J1  10.79,88.9 270 top
JP1  19.05,88.27 270 top
JP2  34.92,88.27 270 top
JP3  5.08,35.56 270 top
JP4  80.64,94.61 0 top
JP5  120.02,17.14 270 top
JP6  152.4,33.66 270 top
JP7  122.56,63.5 270 top
JP8  149.86,95.89 180 top
LED1  87,4.45 270 top
LOGO1  43.18,44.45 0 top
Q1  114.94,73.66 90 top
QG1  8.26,69.85 270 top
R1  26.04,80.64 270 top
R2  29.21,64.77 270 top
R3  21.59,58.42 180 top
R4  5.08,53.34 90 top
R5  5.08,43.81 90 top
R6  5.08,27.3 270 top
R7  29.84,52.7 90 top
R8  118.11,49.53 180 top
R9  121.28,3.17 180 top
R10  87,12.06 90 top
R11  154.31,65.41 180 top
R12  154.31,73.03 270 top
R13  153.03,85.72 0 top
RESET  26.94,93.44 270 top
T1  153.67,81.28 180 top

### Tracks (layer width: path | path; a pad name or v marks a point on that pad's centre or on a via)
!CS_ACIA  (via drill 0.7)
  Top 0.305: v102.23,82.55 v102.23,66.04
  Bottom 0.305: v102.23,66.04 IC11.3 | v102.23,82.55 85.72,82.55 84.45,81.28 IC5.15
!CS_IO
  Bottom 0.305: IC4.8 59.69,68.58 60.96,69.85 60.96,73.66 | 60.96,73.66 60.96,76.2 60.33,76.83 48.9,76.83 48.26,77.47 48.26,84.45 46.99,85.72 IC2.2 | IC5.5 60.96,73.66
!CS_RAM  (via drill 0.7)
  Top 0.305: v69.85,83.82 v69.85,26.04 v69.85,20.95
  Bottom 0.305: IC8.20 v69.85,26.04 | v69.85,83.82 57.78,83.82 57.15,84.45 IC2.6 | IC8.22 v69.85,20.95
!CS_ROM  (via drill 0.7)
  Top 0.305: v38.1,66.67 v38.1,26.04 v38.1,20.95
  Bottom 0.305: IC7.20 v38.1,26.04 | v38.1,66.67 49.53,66.67 | 49.53,66.67 52.07,69.22 | 52.07,69.22 IC3.4 | IC4.12 49.53,66.67 | 52.07,69.22 52.07,74.93 51.44,75.56 46.35,75.56 45.72,76.2 45.72,84.45 44.45,85.72 IC2.1 | IC7.22 v38.1,20.95
!CS_SID  (via drill 0.7)
  Top 0.305: v103.5,74.93 v103.5,87.63
  Bottom 0.305: IC5.12 83.19,73.66 84.45,74.93 v103.5,74.93 | v103.5,87.63 121.28,87.63 121.92,87 121.92,80.64 122.56,80.01 138.43,80.01 139.7,78.74 IC12.8
!CS_VIA1  (via drill 0.7)
  Top 0.305: v89.53,47.62 v89.53,80.64
  Bottom 0.305: v89.53,80.64 87,80.64 85.09,78.74 IC5.14 | IC9.23 v89.53,47.62
!CS_VIA2
  Bottom 0.305: IC10.23 130.81,47.62 131.44,46.99 131.44,44.45 130.81,43.81 125.73,43.81 118.11,51.44 118.11,55.88 116.84,57.15 116.84,66.04 113.03,69.85 106.68,69.85 106.05,70.48 106.05,76.83 105.41,77.47 87,77.47 85.72,76.2 IC5.13
!IRQ  (via drill 0.7)
  Top 0.305: v102.23,63.5 102.23,62.23 v102.23,52.7 102.23,46.99 102.87,46.35 125.73,46.35 126.36,46.99 v126.36,52.7 | v40.01,45.72 v40.01,41.91
  Bottom 0.305: IC11.26 99.69,66.04 v102.23,63.5 | v102.23,52.7 IC9.21 88.27,52.7 87.63,52.07 87.63,46.35 87,45.72 v40.01,45.72 | v40.01,41.91 28.57,41.91 27.94,42.55 27.94,44.45 27.3,45.09 14.61,45.09 13.34,46.35 IC6.4 | v126.36,52.7 IC10.21
  Bottom 0.406: R5.1 5.08,43.81 7.62,46.35 IC6.4
!RESET  (via drill 0.7)
  Top 0.305: v33.66,52.7 33.66,69.22 34.29,69.85 v36.2,69.85 | v113.67,66.04 119.38,66.04 120.02,66.67 v120.02,77.47 | v103.5,19.68 v103.5,43.81
  Bottom 0.305: IC6.40 23.5,53.98 22.86,53.34 22.86,48.26 23.5,47.62 28.57,47.62 29.21,46.99 29.21,43.81 29.84,43.18 88.27,43.18 88.9,43.81 v103.5,43.81 105.41,43.81 106.05,44.45 106.05,45.72 106.68,46.35 113.03,46.35 113.67,46.99 v113.67,66.04 111.12,68.58 IC11.4 | IC6.40 27.3,53.98 28.57,52.7 v33.66,52.7 | IC3.2 46.99,70.48 46.35,69.85 v36.2,69.85 | v120.02,77.47 146.05,77.47 146.69,76.83 146.69,71.12 | IC9.34 v103.5,19.68 | IC10.34 132.72,19.68 133.99,20.95 154.31,20.95 154.94,21.59 154.94,61.59 153.03,63.5 153.03,67.94 149.86,71.12 146.69,71.12 | 146.69,71.12 IC12.5 | R3.1 IC6.40
+12V  (via drill 0.7)
  Top 0.406: v126.36,60.96 126.36,95.25 127,95.89 145.41,95.89 148.59,92.71 148.59,80.64 v149.22,80.01
  Bottom 0.406: JP7.3 v126.36,60.96 | v126.36,60.96 IC12.28 | C16.1 v126.36,60.96 | v149.22,80.01 T1.3
A0  (via drill 0.7)
  Top 0.305: v100.97,9.53 v100.97,28.57 v100.97,91.44
  Bottom 0.305: IC6.9 17.78,33.66 21.59,29.84 48.26,29.84 49.53,28.57 IC7.10 67.94,28.57 69.22,29.84 76.83,29.84 78.11,28.57 IC8.10 v100.97,28.57 | IC9.38 v100.97,9.53 100.97,6.35 101.6,5.71 116.2,5.71 116.84,6.35 116.84,7.62 117.47,8.26 125.09,8.26 126.36,9.53 IC10.38 | v100.97,91.44 IC11.13 123.19,91.44 123.83,90.81 123.83,83.19 124.46,82.55 138.43,82.55 139.7,81.28 IC12.9
A1  (via drill 0.7)
  Top 0.305: v98.42,12.06 v98.42,26.04 v98.42,93.98
  Bottom 0.305: IC6.10 17.78,31.11 21.59,27.3 48.26,27.3 49.53,26.04 IC7.9 67.94,26.04 69.22,27.3 76.83,27.3 78.11,26.04 IC8.9 v98.42,26.04 | IC9.37 v98.42,12.06 105.41,12.06 106.68,13.34 113.03,13.34 115.57,10.79 125.09,10.79 126.36,12.06 IC10.37 | v98.42,93.98 IC11.14 124.46,93.98 125.09,93.34 125.09,85.72 125.73,85.09 138.43,85.09 139.7,83.82 IC12.10
A2  (via drill 0.7)
  Top 0.305: v99.69,23.5 v99.69,14.61 | v147.96,15.88 147.96,53.98 146.69,55.24 142.24,55.24 141.6,55.88 v141.6,86.36
  Bottom 0.305: IC6.11 17.78,28.57 21.59,24.77 48.26,24.77 49.53,23.5 IC7.8 67.94,23.5 69.22,24.77 76.83,24.77 78.11,23.5 IC8.8 v99.69,23.5 | IC9.36 v99.69,14.61 105.41,14.61 106.68,15.88 113.03,15.88 115.57,13.34 124.46,13.34 125.73,14.61 IC10.36 140.97,14.61 142.24,15.88 v147.96,15.88 | v141.6,86.36 IC12.11
A3  (via drill 0.7)
  Top 0.305: v149.22,18.41 149.22,54.61 146.69,57.15 v146.69,88.9
  Bottom 0.305: IC6.12 17.78,26.04 21.59,22.23 48.26,22.23 49.53,20.95 IC7.7 67.94,20.95 69.22,22.23 76.83,22.23 78.11,20.95 IC8.7 89.53,20.95 90.17,20.32 90.17,17.78 90.81,17.14 IC9.35 104.78,17.14 106.05,18.41 113.03,18.41 115.57,15.88 125.09,15.88 126.36,17.14 IC10.35 140.97,17.14 142.24,18.41 v149.22,18.41 | v146.69,88.9 IC12.12
A4  (via drill 0.7)
  Top 0.305: v62.23,18.41 v62.23,50.16 | v104.78,56.52 v104.78,95.89
  Bottom 0.305: IC6.13 17.78,23.5 21.59,19.68 48.26,19.68 49.53,18.41 IC7.6 v62.23,18.41 67.94,18.41 69.22,19.68 76.83,19.68 78.11,18.41 IC8.6 | v62.23,50.16 85.09,50.16 85.72,50.8 85.72,55.88 86.36,56.52 v104.78,56.52 | v104.78,95.89 140.34,95.89 140.97,95.25 140.97,92.08 141.6,91.44 IC12.13
A5  (via drill 0.7)
  Top 0.305: v75.56,17.14 v75.56,83.82
  Bottom 0.305: IC6.14 17.78,20.95 21.59,17.14 48.26,17.14 49.53,15.88 IC7.5 67.94,15.88 69.22,17.14 v75.56,17.14 76.83,17.14 78.11,15.88 IC8.5 | IC5.1 v75.56,83.82
A6  (via drill 0.7)
  Top 0.305: v76.83,14.61 v76.83,81.28
  Bottom 0.305: IC6.15 17.78,18.41 21.59,14.61 48.26,14.61 49.53,13.34 IC7.4 67.94,13.34 69.22,14.61 v76.83,14.61 78.11,13.34 IC8.4 | IC5.2 v76.83,81.28
A7  (via drill 0.7)
  Top 0.305: v78.11,78.74 v78.11,10.79
  Bottom 0.305: IC6.16 17.78,15.88 21.59,12.06 48.26,12.06 49.53,10.79 IC7.3 62.23,10.79 67.94,10.79 69.22,12.06 76.83,12.06 v78.11,10.79 IC8.3 | IC5.3 v78.11,78.74
A8  (via drill 0.7)
  Top 0.305: v67.31,12.06 v67.31,59.69 | v34.92,13.34 34.92,4.45 34.29,3.81 8.89,3.81 7.62,5.08 v7.62,13.34
  Bottom 0.305: IC8.25 69.22,13.34 67.94,12.06 v67.31,12.06 49.53,12.06 48.26,13.34 v34.92,13.34 IC7.25 | IC4.11 52.07,60.33 52.7,59.69 v67.31,59.69 | IC6.17 v7.62,13.34
A9  (via drill 0.7)
  Top 0.305: v29.84,6.99 v29.84,15.88 | v66.04,53.98 v66.04,14.61
  Bottom 0.305: IC8.24 69.22,15.88 67.94,14.61 v66.04,14.61 49.53,14.61 48.26,15.88 IC7.24 v29.84,15.88 | IC6.18 8.26,10.79 7.62,10.16 7.62,7.62 8.26,6.99 v29.84,6.99 | IC4.6 57.15,54.61 57.78,53.98 v66.04,53.98
A10  (via drill 0.7)
  Top 0.305: v36.83,9.53 v36.83,23.5 | v64.77,52.7 v64.77,22.23
  Bottom 0.305: IC8.21 69.22,23.5 67.94,22.23 v64.77,22.23 49.53,22.23 48.26,23.5 IC7.21 v36.83,23.5 | IC6.19 22.23,8.26 23.5,9.53 v36.83,9.53 | IC4.5 54.61,53.34 55.24,52.7 v64.77,52.7
A11  (via drill 0.7)
  Top 0.305: v38.1,2.54 v38.1,18.41 | v63.5,51.44 v63.5,17.14
  Bottom 0.305: IC8.23 69.22,18.41 67.94,17.14 v63.5,17.14 49.53,17.14 48.26,18.41 IC7.23 v38.1,18.41 | IC6.20 13.34,5.71 16.51,2.54 v38.1,2.54 | IC4.4 52.07,52.07 52.7,51.44 v63.5,51.44
A12  (via drill 0.7)
  Top 0.305: v60.96,49.53 v60.96,8.26
  Bottom 0.305: IC8.2 76.2,8.26 74.93,6.99 67.94,6.99 66.67,8.26 v60.96,8.26 IC7.2 49.53,8.26 48.26,9.53 38.73,9.53 37.47,8.26 IC6.22 | IC4.3 49.53,50.16 50.16,49.53 v60.96,49.53
A13  (via drill 0.7)
  Top 0.305: v59.69,48.26 v59.69,9.53
  Bottom 0.305: IC6.23 IC7.26 48.26,10.79 49.53,9.53 v59.69,9.53 68.58,9.53 69.85,10.79 IC8.26 | IC4.2 46.99,48.9 47.62,48.26 v59.69,48.26
A14  (via drill 0.7)
  Top 0.305: v32.38,13.34 v32.38,6.99 | v58.42,46.99 v58.42,5.71
  Bottom 0.305: IC8.1 76.2,5.71 74.93,4.45 69.22,4.45 67.94,5.71 v58.42,5.71 IC7.1 49.53,5.71 48.26,6.99 v32.38,6.99 | IC6.24 v32.38,13.34 | IC4.1 44.45,47.62 45.09,46.99 v58.42,46.99
A15  (via drill 0.7)
  Top 0.305: v22.86,15.88 22.86,41.91 23.5,42.55 36.2,42.55 36.83,43.18 v36.83,67.94
  Bottom 0.305: IC6.25 v22.86,15.88 | v36.83,67.94 48.9,67.94 49.53,68.58 IC3.3
CLK
  Bottom 0.305: QG1.8 15.24,62.23 15.88,61.59 15.88,46.99 16.51,46.35 IC6.37
D0  (via drill 0.7)
  Top 0.305: v27.94,36.2 v27.94,32.38 | v97.16,22.23 v97.16,31.11 v97.16,86.36 | v131.44,93.98 v131.44,22.23
  Bottom 0.305: IC6.33 v27.94,36.2 | v27.94,32.38 48.26,32.38 49.53,31.11 IC7.11 67.94,31.11 69.22,32.38 76.83,32.38 78.11,31.11 IC8.11 v97.16,31.11 | IC9.33 v97.16,22.23 102.87,22.23 104.14,23.5 111.12,23.5 116.2,18.41 123.19,18.41 127,22.23 IC10.33 v131.44,22.23 | v97.16,86.36 IC11.18 | IC12.15 v131.44,93.98
D1  (via drill 0.7)
  Top 0.305: v83.19,24.77 v83.19,33.66 v83.19,83.82 | v132.72,91.44 v132.72,24.77
  Bottom 0.305: IC6.32 28.57,33.66 29.84,34.92 48.26,34.92 49.53,33.66 IC7.12 67.94,33.66 69.22,34.92 76.83,34.92 78.11,33.66 IC8.12 v83.19,33.66 | v83.19,24.77 IC9.32 100.33,24.77 101.6,26.04 110.49,26.04 115.57,20.95 123.19,20.95 127,24.77 IC10.32 v132.72,24.77 | v83.19,83.82 IC11.19 | IC12.16 v132.72,91.44
D2  (via drill 0.7)
  Top 0.305: v29.21,31.11 v29.21,37.47 | v95.89,27.3 v95.89,36.2 v95.89,81.28 | v140.34,27.3 v140.34,88.9
  Bottom 0.305: IC6.31 v29.21,31.11 | v29.21,37.47 48.26,37.47 49.53,36.2 IC7.13 67.94,36.2 69.22,37.47 76.83,37.47 78.11,36.2 IC8.13 v95.89,36.2 | IC9.31 v95.89,27.3 104.14,27.3 105.41,28.57 124.46,28.57 125.73,27.3 IC10.31 v140.34,27.3 | IC11.20 v95.89,81.28 | v140.34,88.9 IC12.17
D3  (via drill 0.7)
  Top 0.305: v30.48,28.57 v30.48,38.73 | v88.27,29.84 v88.27,38.73 v88.27,78.74 | v139.06,29.84 v139.06,86.36
  Bottom 0.305: IC6.30 v30.48,28.57 | v30.48,38.73 IC7.15 48.26,38.73 49.53,37.47 67.94,37.47 69.22,38.73 IC8.15 76.83,38.73 78.11,37.47 83.82,37.47 85.09,38.73 v88.27,38.73 | v88.27,29.84 IC9.30 105.41,29.84 106.68,31.11 124.46,31.11 125.73,29.84 IC10.30 v139.06,29.84 | IC11.21 v88.27,78.74 | v139.06,86.36 IC12.18
D4  (via drill 0.7)
  Top 0.305: v31.75,26.04 v31.75,36.2 | v99.69,76.2 v99.69,32.38 | v137.79,83.82 v137.79,32.38
  Bottom 0.305: IC6.29 v31.75,26.04 | v31.75,36.2 IC7.16 48.26,36.2 49.53,34.92 67.94,34.92 69.22,36.2 IC8.16 76.83,36.2 78.11,34.92 83.82,34.92 85.09,33.66 87.63,33.66 88.9,32.38 IC9.29 v99.69,32.38 105.41,32.38 106.68,33.66 124.46,33.66 125.73,32.38 IC10.29 v137.79,32.38 | IC11.22 v99.69,76.2 | IC12.19 v137.79,83.82
D5  (via drill 0.7)
  Top 0.305: v33.02,23.5 v33.02,33.66 | v87,32.38 v87,34.92 v87,73.66 | v133.99,34.92 v133.99,81.28
  Bottom 0.305: IC6.28 v33.02,23.5 | v33.02,33.66 IC7.17 48.26,33.66 49.53,32.38 67.94,32.38 69.22,33.66 IC8.17 76.83,33.66 78.11,32.38 v87,32.38 | v87,34.92 IC9.28 105.41,34.92 106.68,36.2 124.46,36.2 125.73,34.92 IC10.28 v133.99,34.92 | IC11.23 v87,73.66 | IC12.20 v133.99,81.28
D6  (via drill 0.7)
  Top 0.305: v34.29,20.95 v34.29,31.11 | v85.72,29.84 v85.72,37.47 v85.72,71.12 | v135.25,37.47 v135.25,78.74
  Bottom 0.305: IC6.27 v34.29,20.95 | v34.29,31.11 IC7.18 48.26,31.11 49.53,29.84 67.94,29.84 69.22,31.11 IC8.18 76.83,31.11 78.11,29.84 v85.72,29.84 | v85.72,37.47 IC9.27 105.41,37.47 106.68,38.73 124.46,38.73 125.73,37.47 IC10.27 v135.25,37.47 | IC11.24 v85.72,71.12 | v135.25,78.74 IC12.21
D7  (via drill 0.7)
  Top 0.305: v35.56,18.41 v35.56,28.57 | v84.45,27.3 v84.45,40.01 v84.45,68.58 | v136.53,76.2 v136.53,59.05
  Bottom 0.305: IC6.26 v35.56,18.41 | v35.56,28.57 IC7.19 48.26,28.57 49.53,27.3 67.94,27.3 69.22,28.57 IC8.19 76.83,28.57 78.11,27.3 v84.45,27.3 | v84.45,40.01 IC9.26 105.41,40.01 106.68,41.27 124.46,41.27 125.73,40.01 IC10.26 133.35,40.01 133.99,40.64 133.99,56.52 v136.53,59.05 | IC11.25 v84.45,68.58 | v136.53,76.2 IC12.22
GND  (via drill 0.7)
  Top 0.305: v116.2,12.06 v116.2,3.81
  Top 0.406: v20.95,5.71 v20.95,10.16 | v64.14,71.12 v64.14,76.83 | v136.53,19.68 v136.53,10.16 | v31.75,78.11 v37.47,78.11 | v19.05,97.16 v19.05,92.08 | v115.57,89.53 v115.57,85.72 | v120.65,59.05 120.02,59.69 v115.57,59.69 112.39,59.69 v111.76,60.33
  Bottom 0.305: IC5.4 75.56,76.2 76.2,75.56 76.2,66.67 75.56,66.04 IC5.8 | IC6.21 v20.95,5.71 | JP5.13 v116.2,12.06
  pour Bottom (isolate 0.406): 0,0 0,100 160,100 160,0
LCD_D4  (via drill 0.7)
  Top 0.305: v114.94,23.5 v114.94,6.99
  Bottom 0.305: JP5.4 120.02,23.5 v114.94,23.5 | v114.94,6.99 IC9.2
LCD_D5  (via drill 0.7)
  Top 0.305: v113.67,24.77 v113.67,9.53
  Bottom 0.305: JP5.3 v113.67,24.77 | v113.67,9.53 IC9.3
LCD_D6  (via drill 0.7)
  Top 0.305: v112.39,26.04 v112.39,12.06
  Bottom 0.305: JP5.2 120.02,26.04 v112.39,26.04 | v112.39,12.06 IC9.4
LCD_D7  (via drill 0.7)
  Top 0.305: v111.12,27.3 v111.12,14.61
  Bottom 0.305: JP5.1 v111.12,27.3 | v111.12,14.61 IC9.5
LCD_E1
  Bottom 0.305: IC9.7 113.03,19.68 115.57,17.14 JP5.9
LCD_E2  (via drill 0.7)
  Top 0.305: v104.78,8.26 v104.78,22.23
  Bottom 0.305: JP5.15 115.57,9.53 114.3,8.26 v104.78,8.26 | v104.78,22.23 IC9.8
LCD_RS
  Bottom 0.305: IC9.6 113.03,17.14 115.57,14.61 JP5.11
N$1
  Bottom 0.305: IC11.7 114.81,76.2 Q1.2 116.2,77.34 C7.2
N$2
  Bottom 0.406: IC11.6 112.52,73.66 Q1.1
N$3
  Bottom 0.406: R4.1 5.08,50.8 5.71,51.44 IC6.2
N$4
  Bottom 0.305: 29.21,71.12 IC1.7 IC1.6 | 29.21,71.12 29.84,71.12 C4.+ | R2.1 29.21,71.12
N$5  (via drill 0.7)
  Top 0.305: v39.37,72.39 34.29,72.39 31.75,69.85 21.59,69.85 v20.32,68.58
  Bottom 0.305: IC3.1 v39.37,72.39 | v20.32,68.58 IC1.3
N$6
  Bottom 0.305: IC1.2 19.68,71.12 20.32,71.75 20.32,73.66 22.86,76.2 C3.2 26.04,81.28 R1.1 28.57,84.45 29.21,85.09 29.21,89.53 29.2,89.53 | RESET.2 29.2,89.53 | JP2.1 29.2,89.53
N$7
  Bottom 0.305: IC2.3 49.53,85.09 50.16,84.45 51.44,84.45 52.07,83.82 IC3.11
N$8
  Bottom 0.305: JP4.2 80.64,89.53 85.09,85.09 103.5,85.09 104.78,83.82 IC11.10
N$9  (via drill 0.7)
  Top 0.305: v102.23,24.77 v102.23,15.88
  Bottom 0.305: IC9.9 v102.23,24.77 | R10.2 v102.23,15.88
N$10
  Bottom 0.305: JP3.1 6.99,36.83 6.99,31.75 6.35,31.11 R6.1
  Bottom 0.406: 6.99,36.83 6.99,40.01 8.26,41.27 IC6.6
N$11
  Bottom 0.305: R7.1 IC6.38
N$12
  Bottom 0.305: JP4.3 83.19,90.17 85.72,87.63 100.97,87.63 102.23,88.9 IC11.12
N$13
  Bottom 0.305: IC2.4 52.07,85.72 52.7,85.09 53.98,85.09 54.61,84.45 IC3.10
N$14  (via drill 0.7)
  Top 0.305: v123.83,43.81 v123.83,14.61
  Bottom 0.305: v123.83,14.61 JP5.12 | R8.3 123.19,44.45 v123.83,43.81
N$15
  Bottom 0.305: JP5.17 118.75,4.45 R9.2
N$16
  Bottom 0.305: LED1.A R10.1
N$17  (via drill 0.7)
  Top 0.305: v125.09,63.5 125.09,96.52 125.73,97.16 v146.05,97.16 | v148.59,73.03 149.22,72.39 v149.22,69.85
  Bottom 0.305: v146.05,97.16 146.69,96.52 146.69,92.08 148.59,90.17 148.59,82.55 147.32,81.28 147.32,79.38 148.59,78.11 v148.59,73.03 | R11.2 FB1.1 150.5,68.58 v149.22,69.85
  Bottom 0.406: IC12.27 v125.09,63.5
N$18
  Bottom 0.305: IC12.1 C19.2
N$19
  Bottom 0.305: FB1.2 150.5,73.03 R12.2
N$20
  Bottom 0.305: T1.2 154.31,80.64 R12.1 154.31,75.56 C17.2
N$21
  Bottom 0.305: C18.+ 155.57,88.27 R13.2 155.57,83.19 T1.1
N$22
  Bottom 0.305: JP8.1 151.13,90.17 C18.-
N$24
  Bottom 0.305: IC12.2 C19.1
N$25
  Bottom 0.305: IC12.3 C20.2
N$26
  Bottom 0.305: IC12.4 C20.1
PHI2  (via drill 0.7)
  Top 0.305: v90.81,42.55 v90.81,45.09 v90.81,63.5
  Bottom 0.305: IC2.5 54.61,89.53 53.98,90.17 43.81,90.17 34.92,81.28 34.92,51.44 | 34.92,51.44 34.92,45.09 35.56,44.45 87.63,44.45 88.27,45.09 v90.81,45.09 | IC6.39 34.92,51.44 | v90.81,63.5 IC11.27 | v90.81,42.55 IC9.25 105.41,42.55 106.68,43.81 111.12,43.81 112.39,42.55 IC10.25 132.08,42.55 132.72,43.18 132.72,57.15 141.6,66.04 141.6,73.03 142.24,73.66 IC12.6
R!W  (via drill 0.7)
  Top 0.305: v68.58,8.26 v68.58,40.64 v68.58,60.96 | v103.5,60.96 v103.5,51.44 112.39,51.44 123.83,51.44 v125.09,50.16
  Bottom 0.305: IC6.34 26.67,38.73 27.94,40.01 48.26,40.01 48.9,40.64 v68.58,40.64 | v68.58,8.26 IC8.27 | v68.58,60.96 90.17,60.96 IC11.28 v103.5,60.96 | v125.09,50.16 IC10.22 130.81,50.16 131.44,50.8 131.44,57.78 140.34,66.67 140.34,75.56 140.97,76.2 IC12.7 | IC9.22 95.89,50.16 102.23,50.16 v103.5,51.44
VCC  (via drill 0.7)
  Top 0.406: v43.81,8.26 v43.81,5.71 43.81,3.81 | v16.51,5.08 v16.51,36.2 | v41.91,64.77 v41.91,80.01 v41.91,94.61 | v69.85,5.71 69.85,3.81 | 69.85,3.81 v69.85,2.54 | v43.81,2.54 43.81,3.81 | v106.05,63.5 v106.05,97.79 | v146.69,52.7 146.69,13.34 v146.69,3.17 | v126.36,45.09 v126.36,13.34 v126.36,3.17 | v112.39,63.5 v118.75,63.5 | 43.81,3.81 69.85,3.81
  Bottom 0.305: v41.91,80.01 41.27,80.01 | 41.27,64.77 v41.91,64.77 | 41.91,95.25 v41.91,94.61 | 22.23,63.5 26.67,63.5 R2.2 29.84,60.33 R7.2 | 9.53,36.2 8.26,36.2 7.62,34.92 7.62,29.21 6.99,28.57
  Bottom 0.406: R1.2 25.4,76.2 IC1.8 22.86,73.66 22.23,73.03 22.23,63.5 17.78,63.5 | 17.78,63.5 IC1.4 12.06,66.04 | 17.78,63.5 17.78,62.23 | C2.2 17.78,62.23 | v16.51,5.08 17.78,3.81 27.3,3.81 29.21,5.71 IC7.28 v43.81,5.71 | IC7.27 v43.81,8.26 | v16.51,36.2 IC6.8 9.53,36.2 | IC4.14 v41.91,64.77 | C1.2 40.64,79.38 41.27,80.01 | IC3.14 v41.91,80.01 | 40.64,94.61 v41.91,94.61 | C10.2 40.64,94.61 | IC8.28 v69.85,5.71 | v69.85,2.54 C9.2 | C11.2 40.64,64.14 41.27,64.77 | C6.2 v43.81,2.54 | IC5.16 80.64,85.72 75.56,85.72 | IC5.6 74.93,71.12 75.56,71.75 75.56,74.3 74.93,74.93 71.75,74.93 71.12,75.56 71.12,85.09 71.75,85.72 75.56,85.72 | 75.56,97.79 80.64,97.79 88.9,97.79 | 75.56,97.79 42.55,97.79 41.91,97.16 41.91,95.25 IC2.14 | IC11.15 C8.2 88.9,97.79 | 88.9,97.79 v106.05,97.79 | JP5.14 125.09,12.06 v126.36,13.34 | IC10.24 v126.36,45.09 123.83,47.62 123.83,48.9 123.83,54.61 | IC10.20 v146.69,52.7 | C13.2 111.12,53.34 110.49,52.7 IC9.20 104.78,52.7 | 75.56,97.79 C12.2 75.56,85.72 | v112.39,63.5 IC11.2 v106.05,63.5 106.05,55.88 104.78,54.61 104.78,52.7 | 122.56,68.58 119.38,68.58 118.75,67.94 v118.75,63.5 118.75,57.78 120.65,55.88 R8.1 123.83,54.61 | 122.56,68.58 123.83,68.58 | 123.83,68.58 IC12.25 | 104.78,52.7 104.78,45.72 104.14,45.09 IC9.24 | C15.2 123.83,68.58 | R9.1 v126.36,3.17 v146.69,3.17 | JP7.1 122.56,68.58 | R6.2 C5.2 R6.2 | 123.83,54.61 C14.2 | 17.78,62.23 R3.2 | 12.06,66.04 8.89,66.04 8.26,65.41 8.26,57.78 7.62,57.15 R4.2 3.17,55.24 3.17,47.62 | 12.06,66.04 QG1.14 10.79,78.74 J1.3 14.14,85.9 14.61,86.36 14.61,88.9 15.24,89.53 JP1.1 21.59,89.53 22.23,90.17 22.23,93.98 22.86,94.61 40.64,94.61 | 3.17,47.62 3.17,38.73 1.91,37.47 1.91,34.29 3.17,33.02 3.17,28.57
  Bottom 0.406: R5.2 3.17,47.62 | R6.2 3.17,25.4 3.17,28.57 | 6.99,28.57 3.17,28.57
VIA1_PB0  (via drill 0.7)
  Top 0.305: v106.05,27.3 106.05,1.91 106.68,1.27 140.97,1.27 141.6,1.91 v141.6,24.77
  Bottom 0.305: JP6.6 150.5,47.62 149.22,46.35 142.24,46.35 141.6,45.72 v141.6,24.77 | IC9.10 v106.05,27.3
VIA1_PB1
  Bottom 0.305: IC9.11 124.46,29.84 125.73,28.57 139.7,28.57 140.34,29.21 140.34,48.26 140.97,48.9 149.22,48.9 150.5,50.16 JP6.5
VIA1_PB2
  Bottom 0.305: IC9.12 124.46,32.38 125.73,31.11 138.43,31.11 139.06,31.75 139.06,50.8 139.7,51.44 149.22,51.44 150.5,52.7 JP6.4
VIA1_PB3
  Bottom 0.305: IC9.13 124.46,34.92 125.73,33.66 137.16,33.66 137.79,34.29 137.79,53.34 138.43,53.98 149.22,53.98 150.5,55.24 JP6.3
VIA1_PB4
  Bottom 0.305: IC9.14 124.46,37.47 125.73,36.2 135.89,36.2 136.53,36.83 136.53,54.61 137.16,55.24 147.96,55.24 150.5,57.78 JP6.2
VIA1_PB5
  Bottom 0.305: IC9.15 124.46,40.01 125.73,38.73 134.62,38.73 135.25,39.37 135.25,55.88 135.89,56.52 147.32,56.52 151.13,60.33 JP6.1
VIA2_PA0
  Bottom 0.305: IC10.2 JP6.22
VIA2_PA1
  Bottom 0.305: IC10.3 JP6.21
VIA2_PA2
  Bottom 0.305: IC10.4 JP6.20
VIA2_PA3
  Bottom 0.305: IC10.5 JP6.19
VIA2_PA4
  Bottom 0.305: IC10.6 JP6.18
VIA2_PA5
  Bottom 0.305: IC10.7 JP6.17
VIA2_PA6
  Bottom 0.305: IC10.8 JP6.16
VIA2_PA7
  Bottom 0.305: IC10.9 JP6.15
VIA2_PB0
  Bottom 0.305: IC10.10 JP6.14
VIA2_PB1
  Bottom 0.305: IC10.11 JP6.13
VIA2_PB2
  Bottom 0.305: IC10.12 JP6.12
VIA2_PB3
  Bottom 0.305: IC10.13 JP6.11
VIA2_PB4
  Bottom 0.305: IC10.14 JP6.10
VIA2_PB5
  Bottom 0.305: IC10.15 JP6.9
VIA2_PB6
  Bottom 0.305: IC10.16 JP6.8
VIA2_PB7
  Bottom 0.305: IC10.17 JP6.7

### Text on the board
tNames: 6502 HomeComputer by Dirk Grappendorf